# EAGLE design HeadNode V2 (EAGLE 6.4)

## Sheet 1 of 5: Power
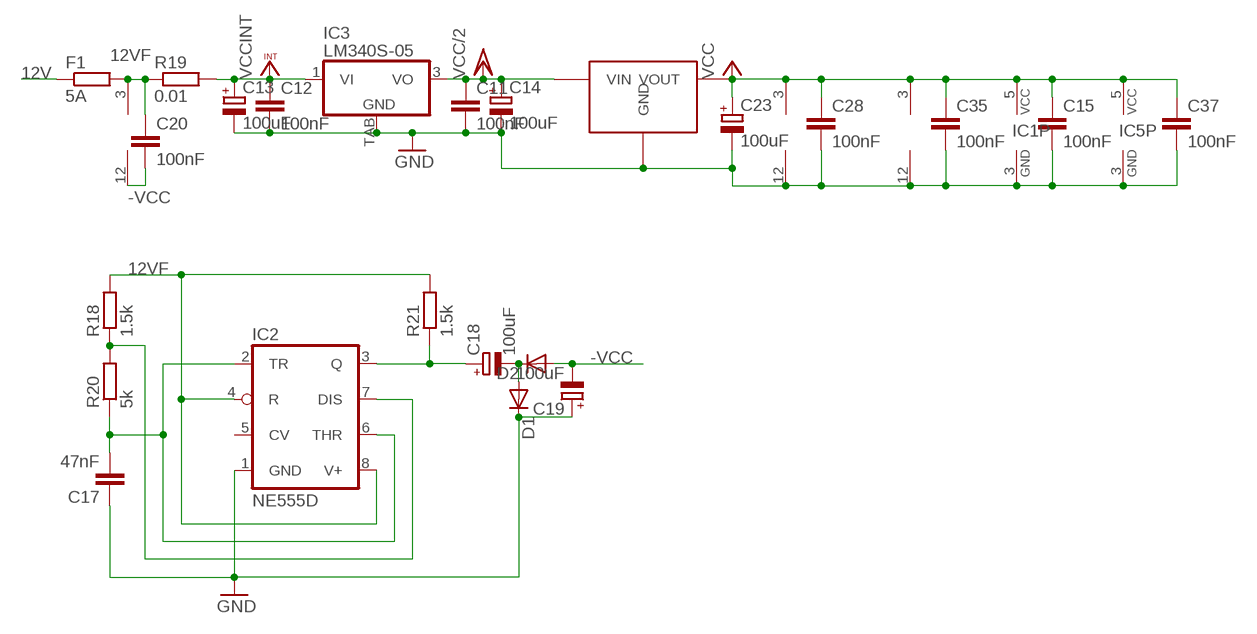
[diagram p0: schematic, sheet 1]

### Parts
C11  100nF  C-EUC0805  [C0805]
C12  100nF  C-EUC0805  [C0805]
C13  100uF  CPOL-EU153CLV-0605  [153CLV-0605]
C14  100uF  CPOL-EU153CLV-0605  [153CLV-0605]
C15  100nF  C-EUC0805  [C0805]
C17  47nF  C-EUC0805  [C0805]
C18  100uF  CPOL-EUD  [PANASONIC_D]
C19  100uF  CPOL-EUD  [PANASONIC_D]
C20  100nF  C-EUC0805  [C0805]
C23  100uF  CPOL-EU153CLV-0605  [153CLV-0605]
C28  100nF  C-EUC0805  [C0805]
C35  100nF  C-EUC0805  [C0805]
C37  100nF  C-EUC0805  [C0805]
D1  DIODE-DO214AA  [DO214AA]
D2  DIODE-DO214AA  [DO214AA]
F1  5A  R-EU_R1206  [R1206]
IC1  74AHCT1G14DBV  [SOT23-5]
IC2  NE555D  [SO08]
IC3  LM340S-05  [TO263-3]
IC4  LM339D  [SO14]
IC5  74AHCT1G14DBV  [SOT23-5]
IC6  LM339D  [SO14]
IC7  LM339D  [SO14]
R18  1.5k  R-EU_R0805  [R0805]
R19  0.01  R-EU_R4527  [R4527]
R20  5k  R-EU_R0805  [R0805]
R21  1.5k  R-EU_R0805  [R0805]
U$5  TS2940  [TO-252]

### Nets
12V: F1.1 ; also sheet 4
12VF: C20.1 F1.2 IC2.4(R) IC2.8(V+) IC4.3(P:V+) R18.2 R19.1 R21.2 ; also sheet 3
-VCC: C19.- C20.2 D2.A IC4.12(P:GND)
GND: C11.2 C12.2 C13.- C14.- C15.2 C17.1 C19.+ C23.- C28.2 C35.2 C37.2 D1.C IC1.3(GND) IC2.1(GND) IC3.TAB(GND) IC5.3(GND) IC6.12(P:GND) IC7.12(P:GND) U$5.GND ; also sheet 2,3,4,5
N$8: C18.+ IC2.3(Q) R21.1
N$10: C18.- D1.A D2.C
N$12: IC2.7(DIS) R18.1 R20.2
N$13: C17.2 IC2.2(TR) IC2.6(THR) R20.1
VCC: C15.1 C23.+ C28.1 C35.1 C37.1 IC1.5(VCC) IC5.5(VCC) IC6.3(P:V+) IC7.3(P:V+) U$5.VOUT ; also sheet 2,3,4,5
VCC/2: C11.1 C14.+ IC3.3(VO) U$5.VIN ; also sheet 4,5
VCCINT: C12.1 C13.+ IC3.1(VI) R19.2 ; also sheet 3
Unconnected: IC2.5(CV)

## Sheet 2 of 5: Logic level
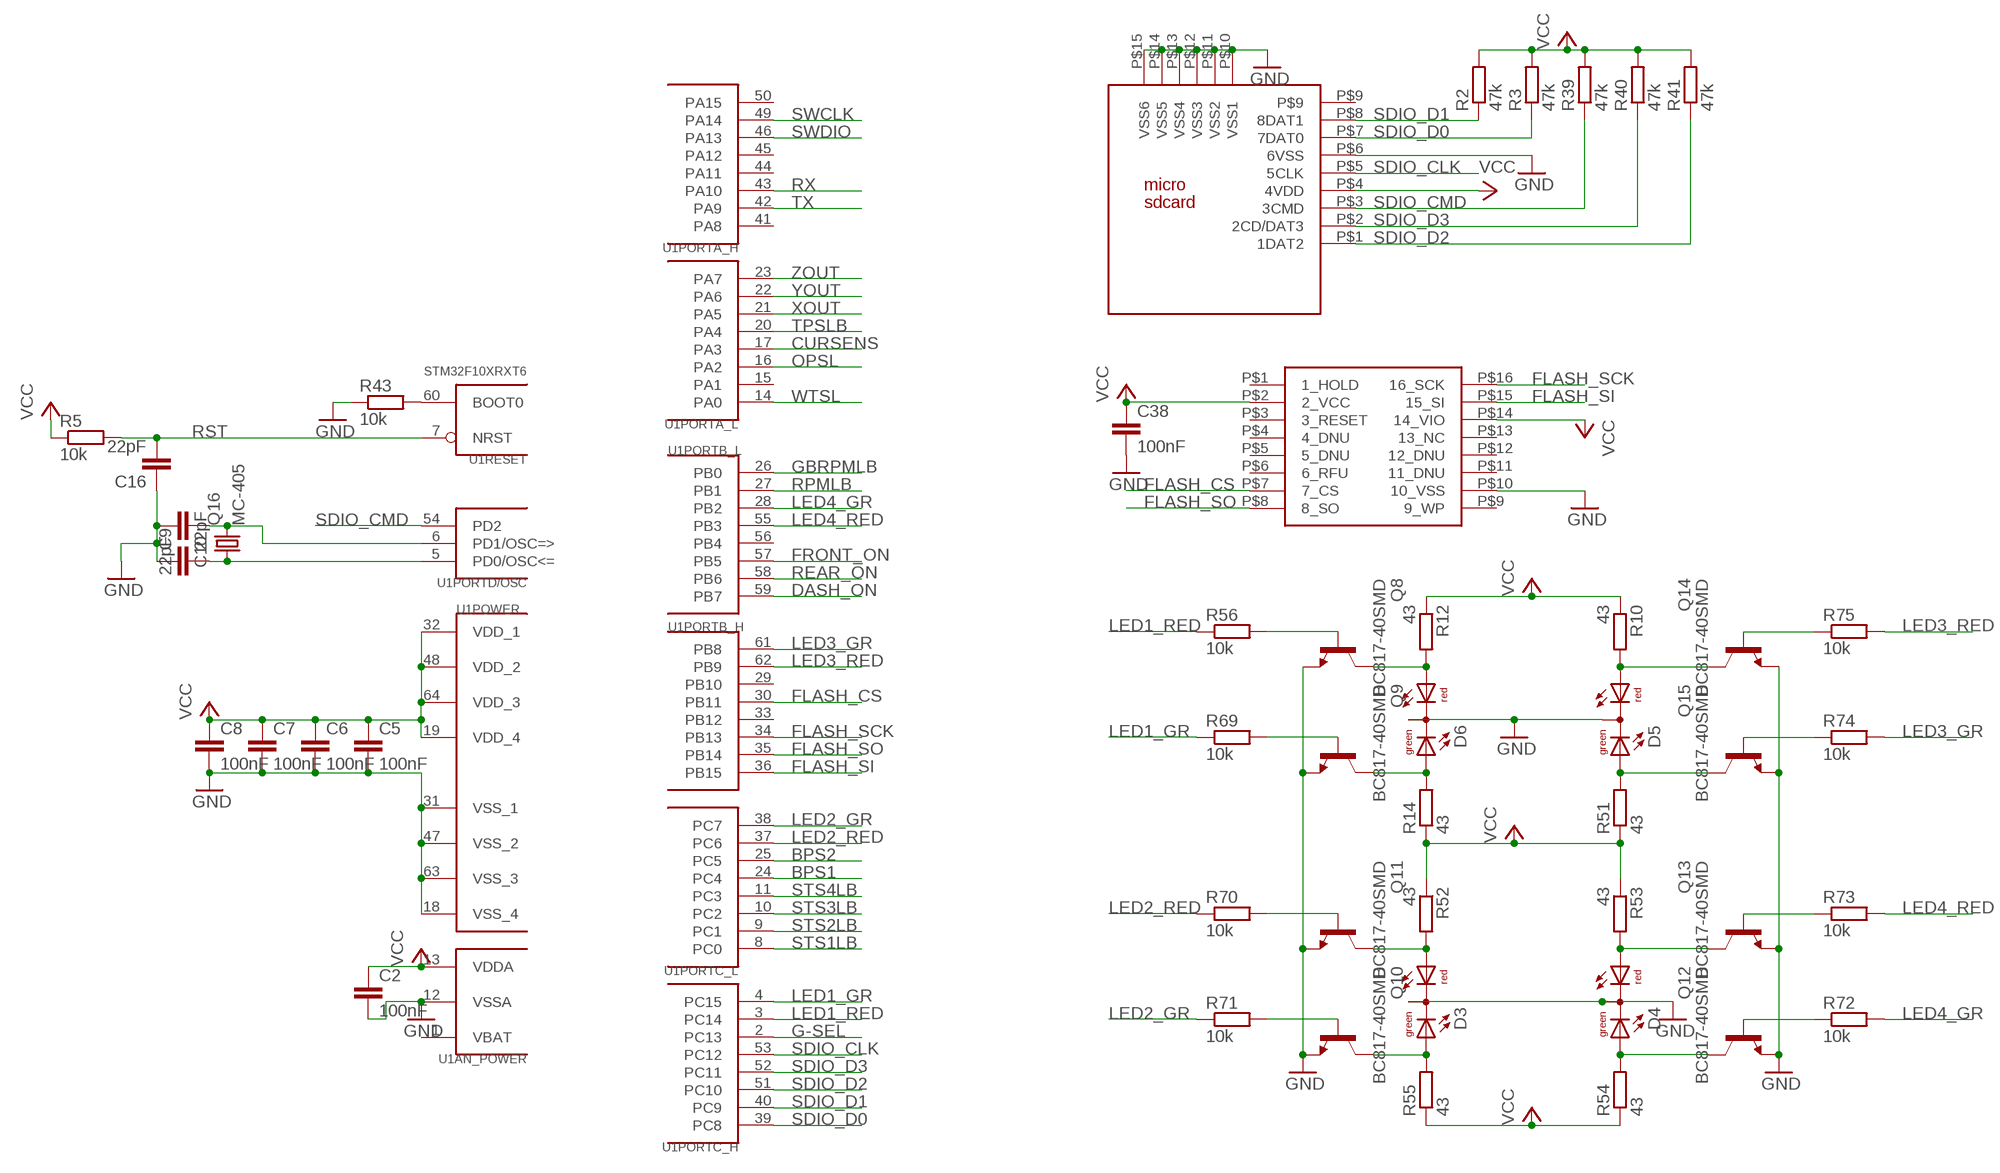
[diagram p1: schematic, sheet 2]

### Parts
C2  100nF  C-EUC0805  [C0805]
C5  100nF  C-EUC0805  [C0805]
C6  100nF  C-EUC0805  [C0805]
C7  100nF  C-EUC0805  [C0805]
C8  100nF  C-EUC0805  [C0805]
C9  22pF  C-EUC0805  [C0805]
C10  22pF  C-EUC0805  [C0805]
C16  22pF  C-EUC0805  [C0805]
C38  100nF  C-EUC0805  [C0805]
D3  DUOLED5MM  [DUOLED5MM]
D4  DUOLED5MM  [DUOLED5MM]
D5  DUOLED5MM  [DUOLED5MM]
D6  DUOLED5MM  [DUOLED5MM]
Q8  BC817-40SMD  [SOT23-BEC]
Q9  BC817-40SMD  [SOT23-BEC]
Q10  BC817-40SMD  [SOT23-BEC]
Q11  BC817-40SMD  [SOT23-BEC]
Q12  BC817-40SMD  [SOT23-BEC]
Q13  BC817-40SMD  [SOT23-BEC]
Q14  BC817-40SMD  [SOT23-BEC]
Q15  BC817-40SMD  [SOT23-BEC]
Q16  MC-405  [MC-405]
R2  47k  R-EU_R0805  [R0805]
R3  47k  R-EU_R0805  [R0805]
R5  10k  R-EU_M0805  [M0805]
R10  43  R-EU_R0805  [R0805]
R12  43  R-EU_R0805  [R0805]
R14  43  R-EU_R0805  [R0805]
R39  47k  R-EU_R0805  [R0805]
R40  47k  R-EU_R0805  [R0805]
R41  47k  R-EU_R0805  [R0805]
R43  10k  R-EU_M0805  [M0805]
R51  43  R-EU_R0805  [R0805]
R52  43  R-EU_R0805  [R0805]
R53  43  R-EU_R0805  [R0805]
R54  43  R-EU_R0805  [R0805]
R55  43  R-EU_R0805  [R0805]
R56  10k  R-EU_R0805  [R0805]
R69  10k  R-EU_R0805  [R0805]
R70  10k  R-EU_R0805  [R0805]
R71  10k  R-EU_R0805  [R0805]
R72  10k  R-EU_R0805  [R0805]
R73  10k  R-EU_R0805  [R0805]
R74  10k  R-EU_R0805  [R0805]
R75  10k  R-EU_R0805  [R0805]
U1  STM32F10XRXT6  [TQFP64]
U$2  MICRO  [MICRO]
U$7  S25FL512SAGMFIG11  [16SOIC]

### Nets
BPS1: U1.24(PORTC_L:PC4) ; also sheet 4
BPS2: U1.25(PORTC_L:PC5) ; also sheet 4
CURSENS: U1.17(PORTA_L:PA3) ; also sheet 3
DASH_ON: U1.59(PORTB_L:PB7) ; also sheet 4
FLASH_CS: U1.30(PORTB_H:PB11) U$7.P$7(7_CS)
FLASH_SCK: U1.34(PORTB_H:PB13) U$7.P$16(16_SCK)
FLASH_SI: U1.36(PORTB_H:PB15) U$7.P$15(15_SI)
FLASH_SO: U1.35(PORTB_H:PB14) U$7.P$8(8_SO)
FRONT_ON: U1.57(PORTB_L:PB5) ; also sheet 4
G-SEL: U1.2(PORTC_H:PC13) ; also sheet 3
GBRPMLB: U1.26(PORTB_L:PB0) ; also sheet 3
GND: C2.2 C5.2 C6.2 C7.2 C8.2 C9.1 C10.2 C16.1 C38.2 D3.K(C) D4.K(C) D5.K(C) D6.K(C) Q8.E Q9.E Q10.E Q11.E Q12.E Q13.E Q14.E Q15.E R43.1 U1.12(AN_POWER:VSSA) U1.18(POWER:VSS_4) U1.31(POWER:VSS_1) U1.47(POWER:VSS_2) U1.63(POWER:VSS_3) U$2.P$6(6VSS) U$2.P$10(VSS1) U$2.P$11(VSS2) U$2.P$12(VSS3) U$2.P$13(VSS4) U$2.P$14(VSS5) U$2.P$15(VSS6) U$7.P$10(10_VSS) ; also sheet 1,3,4,5
LED1_GR: R69.1 U1.4(PORTC_H:PC15)
LED1_RED: R56.1 U1.3(PORTC_H:PC14)
LED2_GR: R71.1 U1.38(PORTC_L:PC7)
LED2_RED: R70.1 U1.37(PORTC_L:PC6)
LED3_GR: R74.2 U1.61(PORTB_H:PB8)
LED3_RED: R75.2 U1.62(PORTB_H:PB9)
LED4_GR: R72.2 U1.28(PORTB_L:PB2)
LED4_RED: R73.2 U1.55(PORTB_L:PB3)
N$2: R43.2 U1.60(RESET:BOOT0)
N$4: C9.2 Q16.1 U1.5(PORTD/OSC:PD0/OSC<=)
N$5: C10.1 Q16.2 U1.6(PORTD/OSC:PD1/OSC=>)
N$6: D5.AR Q14.C R10.2
N$9: D6.AR Q8.C R12.2
N$33: D6.AG Q9.C R14.2
N$50: D5.AG Q15.C R51.2
N$51: D3.AR Q11.C R52.2
N$52: D4.AR Q13.C R53.2
N$53: D4.AG Q12.C R54.2
N$54: D3.AG Q10.C R55.2
N$57: Q8.B R56.2
N$58: Q9.B R69.2
N$59: Q11.B R70.2
N$60: Q10.B R71.2
N$61: Q12.B R72.1
N$62: Q13.B R73.1
N$63: Q15.B R74.1
N$64: Q14.B R75.1
OPSL: U1.16(PORTA_L:PA2) ; also sheet 3
REAR_ON: U1.58(PORTB_L:PB6) ; also sheet 4
RPMLB: U1.27(PORTB_L:PB1) ; also sheet 3
RST: C16.2 R5.2 U1.7(RESET:NRST) ; also sheet 4
RX: U1.43(PORTA_H:PA10) ; also sheet 5
SDIO_CLK: U1.53(PORTC_H:PC12) U$2.P$5(5CLK)
SDIO_CMD: R39.1 U1.54(PORTD/OSC:PD2) U$2.P$3(3CMD)
SDIO_D0: R3.1 U1.39(PORTC_H:PC8) U$2.P$7(7DAT0)
SDIO_D1: R2.1 U1.40(PORTC_H:PC9) U$2.P$8(8DAT1)
SDIO_D2: R41.1 U1.51(PORTC_H:PC10) U$2.P$1(1DAT2)
SDIO_D3: R40.1 U1.52(PORTC_H:PC11) U$2.P$2(2CD/DAT3)
STS1LB: U1.8(PORTC_L:PC0) ; also sheet 3
STS2LB: U1.9(PORTC_L:PC1) ; also sheet 3
STS3LB: U1.10(PORTC_L:PC2) ; also sheet 3
STS4LB: U1.11(PORTC_L:PC3) ; also sheet 3
SWCLK: U1.49(PORTA_H:PA14) ; also sheet 4
SWDIO: U1.46(PORTA_H:PA13) ; also sheet 4
TPSLB: U1.20(PORTA_L:PA4) ; also sheet 3
TX: U1.42(PORTA_H:PA9) ; also sheet 5
VCC: C2.1 C5.1 C6.1 C7.1 C8.1 C38.1 R2.2 R3.2 R5.1 R10.1 R12.1 R14.1 R39.2 R40.2 R41.2 R51.1 R52.1 R53.1 R54.1 R55.1 U1.13(AN_POWER:VDDA) U1.19(POWER:VDD_4) U1.32(POWER:VDD_1) U1.48(POWER:VDD_2) U1.64(POWER:VDD_3) U$2.P$4(4VDD) U$7.P$2(2_VCC) U$7.P$14(14_VIO) ; also sheet 1,3,4,5
WTSL: U1.14(PORTA_L:PA0) ; also sheet 3
XOUT: U1.21(PORTA_L:PA5) ; also sheet 3
YOUT: U1.22(PORTA_L:PA6) ; also sheet 3
ZOUT: U1.23(PORTA_L:PA7) ; also sheet 3
Unconnected: U1.15(PORTA_L:PA1) U1.29(PORTB_H:PB10) U1.33(PORTB_H:PB12) U1.41(PORTA_H:PA8) U1.44(PORTA_H:PA11) U1.45(PORTA_H:PA12) U1.50(PORTA_H:PA15) U1.56(PORTB_L:PB4) U$2.P$9 U$7.P$1(1_HOLD) U$7.P$3(3_RESET) U$7.P$4(4_DNU) U$7.P$5(5_DNU) U$7.P$6(6_RFU) U$7.P$9(9_WP) U$7.P$11(11_DNU) U$7.P$12(12_DNU) U$7.P$13(13_NC)

## Sheet 3 of 5: Analog
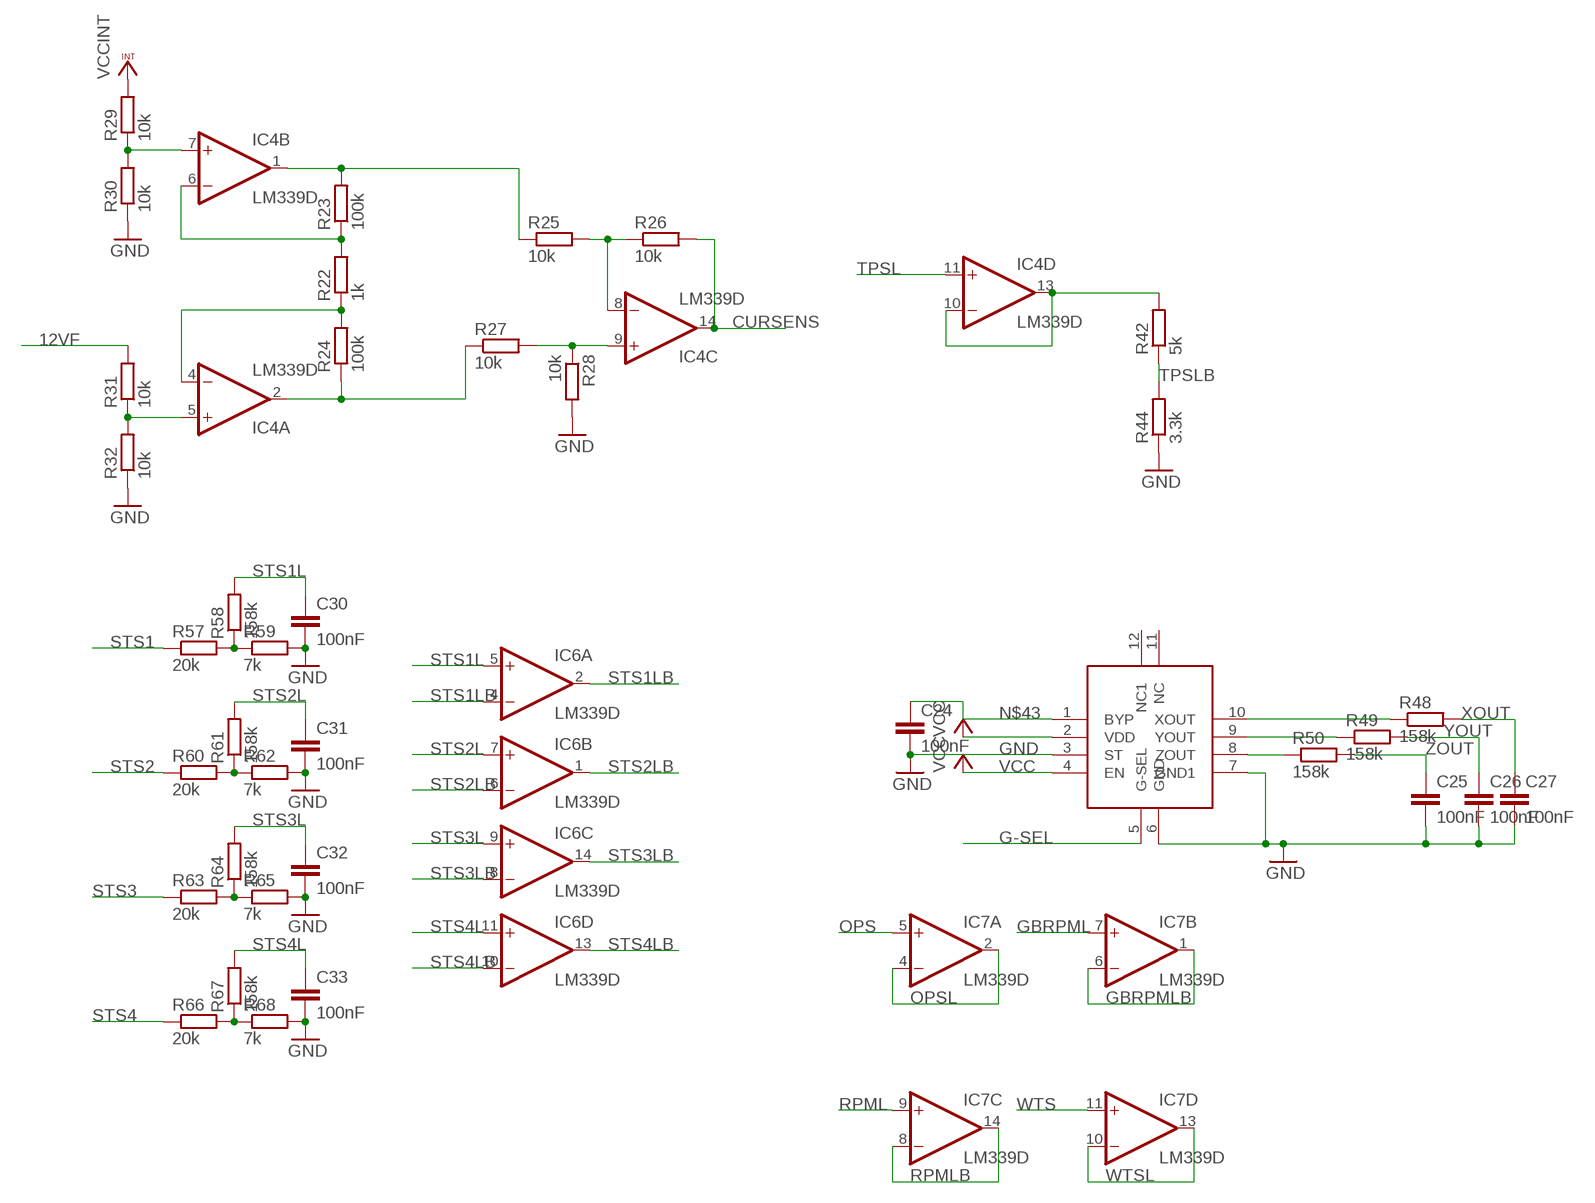
[diagram p2: schematic, sheet 3]

### Parts
C24  100nF  C-EUC0805  [C0805]
C25  100nF  C-EUC0805  [C0805]
C26  100nF  C-EUC0805  [C0805]
C27  100nF  C-EUC0805  [C0805]
C30  100nF  C-EUC0805  [C0805]
C31  100nF  C-EUC0805  [C0805]
C32  100nF  C-EUC0805  [C0805]
C33  100nF  C-EUC0805  [C0805]
R22  1k  R-EU_M0805  [M0805]
R23  100k  R-EU_M0805  [M0805]
R24  100k  R-EU_M0805  [M0805]
R25  10k  R-EU_M0805  [M0805]
R26  10k  R-EU_M0805  [M0805]
R27  10k  R-EU_M0805  [M0805]
R28  10k  R-EU_M0805  [M0805]
R29  10k  R-EU_M0805  [M0805]
R30  10k  R-EU_M0805  [M0805]
R31  10k  R-EU_M0805  [M0805]
R32  10k  R-EU_M0805  [M0805]
R42  5k  R-EU_R0805  [R0805]
R44  3.3k  R-EU_R0805  [R0805]
R48  158k  R-EU_R0805  [R0805]
R49  158k  R-EU_R0805  [R0805]
R50  158k  R-EU_R0805  [R0805]
R57  20k  R-EU_R0805  [R0805]
R58  158k  R-EU_R0805  [R0805]
R59  7k  R-EU_R0805  [R0805]
R60  20k  R-EU_R0805  [R0805]
R61  158k  R-EU_R0805  [R0805]
R62  7k  R-EU_R0805  [R0805]
R63  20k  R-EU_R0805  [R0805]
R64  158k  R-EU_R0805  [R0805]
R65  7k  R-EU_R0805  [R0805]
R66  20k  R-EU_R0805  [R0805]
R67  158k  R-EU_R0805  [R0805]
R68  7k  R-EU_R0805  [R0805]
U$6  FXLN8371QR1  [QFN]

### Nets
12VF: R31.2 ; also sheet 1
CURSENS: IC4.14(C:OUT) R26.2 ; also sheet 2
G-SEL: U$6.5(G-SEL) ; also sheet 2
GBRPML: IC7.7(B:+IN) ; also sheet 4
GBRPMLB: IC7.1(B:OUT) IC7.6(B:-IN) ; also sheet 2
GND: C24.2 C25.2 C26.2 C27.2 C30.2 C31.2 C32.2 C33.2 R28.2 R30.1 R32.1 R44.1 R59.2 R62.2 R65.2 R68.2 U$6.3(ST) U$6.6(GND) U$6.7(GND1) ; also sheet 1,2,4,5
N$7: IC4.6(B:-IN) R22.2 R23.1
N$11: IC4.4(A:-IN) R22.1 R24.2
N$14: IC4.9(C:+IN) R27.2 R28.1
N$16: IC4.1(B:OUT) R23.2 R25.1
N$17: IC4.8(C:-IN) R25.2 R26.1
N$18: IC4.7(B:+IN) R29.1 R30.2
N$19: IC4.5(A:+IN) R31.1 R32.2
N$29: R57.2 R58.1 R59.1
N$36: IC4.10(D:-IN) IC4.13(D:OUT) R42.2
N$37: IC4.2(A:OUT) R24.1 R27.1
N$39: R48.1 U$6.10(XOUT)
N$40: R49.1 U$6.9(YOUT)
N$41: R50.1 U$6.8(ZOUT)
N$43: C24.1 U$6.1(BYP)
N$44: R60.2 R61.1 R62.1
N$46: R63.2 R64.1 R65.1
N$48: R66.2 R67.1 R68.1
OPS: IC7.5(A:+IN) ; also sheet 4
OPSL: IC7.2(A:OUT) IC7.4(A:-IN) ; also sheet 2
RPML: IC7.9(C:+IN) ; also sheet 4
RPMLB: IC7.8(C:-IN) IC7.14(C:OUT) ; also sheet 2
STS1: R57.1 ; also sheet 4
STS1L: C30.1 IC6.5(A:+IN) R58.2
STS1LB: IC6.2(A:OUT) IC6.4(A:-IN) ; also sheet 2
STS2: R60.1 ; also sheet 4
STS2L: C31.1 IC6.7(B:+IN) R61.2
STS2LB: IC6.1(B:OUT) IC6.6(B:-IN) ; also sheet 2
STS3: R63.1 ; also sheet 4
STS3L: C32.1 IC6.9(C:+IN) R64.2
STS3LB: IC6.8(C:-IN) IC6.14(C:OUT) ; also sheet 2
STS4: R66.1 ; also sheet 4
STS4L: C33.1 IC6.11(D:+IN) R67.2
STS4LB: IC6.10(D:-IN) IC6.13(D:OUT) ; also sheet 2
TPSL: IC4.11(D:+IN) ; also sheet 4
TPSLB: R42.1 R44.2 ; also sheet 2
VCC: U$6.2(VDD) U$6.4(EN) ; also sheet 1,2,4,5
VCCINT: R29.2 ; also sheet 1
WTS: IC7.11(D:+IN) ; also sheet 4
WTSL: IC7.10(D:-IN) IC7.13(D:OUT) ; also sheet 2
XOUT: C27.1 R48.2 ; also sheet 2
YOUT: C26.1 R49.2 ; also sheet 2
ZOUT: C25.1 R50.2 ; also sheet 2
Unconnected: U$6.11(NC) U$6.12(NC1)

## Sheet 4 of 5: Connection
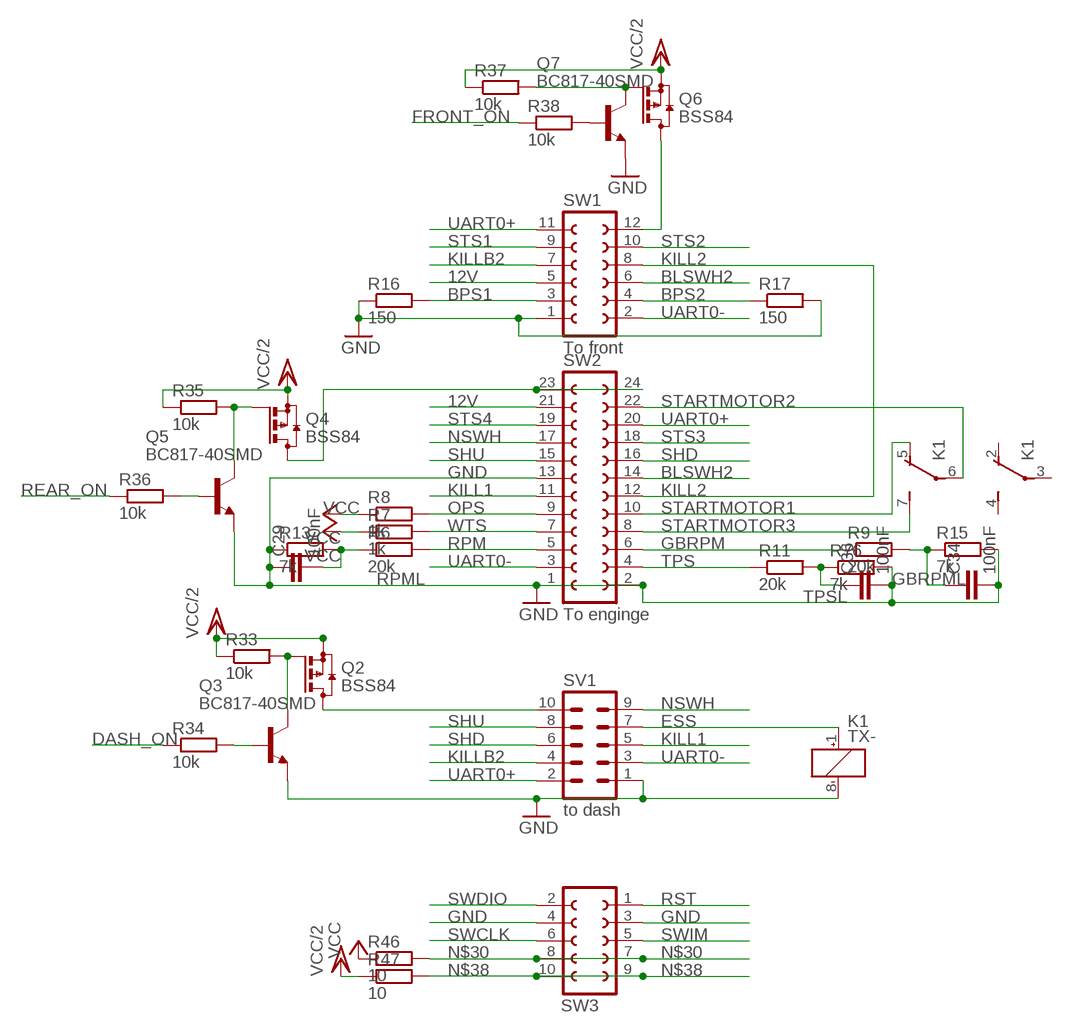
[diagram p3: schematic, sheet 4]

### Parts
C29  100nF  C-EUC0805  [C0805]
C34  100nF  C-EUC0805  [C0805]
C36  100nF  C-EUC0805  [C0805]
K1  TX-  [AGQ]
Q2  BSS84  [SOT23]
Q3  BC817-40SMD  [SOT23-BEC]
Q4  BSS84  [SOT23]
Q5  BC817-40SMD  [SOT23-BEC]
Q6  BSS84  [SOT23]
Q7  BC817-40SMD  [SOT23-BEC]
R6  20k  R-EU_R0805  [R0805]
R7  1k  R-EU_R0805  [R0805]
R8  1k  R-EU_R0805  [R0805]
R9  20k  R-EU_R0805  [R0805]
R11  20k  R-EU_R0805  [R0805]
R13  7k  R-EU_R0805  [R0805]
R15  7k  R-EU_R0805  [R0805]
R16  150  R-EU_R0805  [R0805]
R17  150  R-EU_R0805  [R0805]
R33  10k  R-EU_R0805  [R0805]
R34  10k  R-EU_R0805  [R0805]
R35  10k  R-EU_R0805  [R0805]
R36  10k  R-EU_R0805  [R0805]
R37  10k  R-EU_R0805  [R0805]
R38  10k  R-EU_R0805  [R0805]
R46  10  R-EU_R0805  [R0805]
R47  10  R-EU_R0805  [R0805]
R76  7k  R-EU_R0805  [R0805]
SV1  to dash  MA05-2  [MA05-2]
SW1  To front  FE06-2  [FE06-2]
SW2  To enginge  FE12-2  [FE12-2]
SW3  To front  FE05-2W  [FE05-2W]

### Nets
12V: SW1.5 SW2.21 ; also sheet 1
BLSWH2: SW1.6 SW2.14
BPS1: R16.2 SW1.3 ; also sheet 2
BPS2: R17.1 SW1.4 ; also sheet 2
DASH_ON: R34.1 ; also sheet 2
ESS: K1.1(_:+) SV1.7
FRONT_ON: R38.1 ; also sheet 2
GBRPM: R9.1 SW2.6
GBRPML: C34.1 R9.2 R15.1 ; also sheet 3
GND: C29.1 C34.2 C36.2 K1.8(_:-) Q3.E Q5.E Q7.E R13.1 R15.2 R16.1 R17.2 R76.2 SV1.1 SW1.1 SW2.1 SW2.2 SW2.13 SW3.3 SW3.4 ; also sheet 1,2,3,5
KILL1: SV1.5 SW2.11
KILL2: SW1.8 SW2.12
KILLB2: SV1.4 SW1.7
N$20: Q2.3(D) SV1.10
N$21: Q3.B R34.2
N$22: Q2.1(G) Q3.C R33.2
N$23: Q4.3(D) SW2.23 SW2.24
N$24: Q4.1(G) Q5.C R35.2
N$25: Q5.B R36.2
N$26: Q6.3(D) SW1.12
N$27: Q6.1(G) Q7.C R37.2
N$28: Q7.B R38.2
N$30: R46.2 SW3.7 SW3.8
N$38: R47.2 SW3.9 SW3.10
NSWH: SV1.9 SW2.17
OPS: R8.2 SW2.9 ; also sheet 3
REAR_ON: R36.1 ; also sheet 2
RPM: R6.2 SW2.5
RPML: C29.2 R6.1 R13.2 ; also sheet 3
RST: SW3.1 ; also sheet 2
SHD: SV1.6 SW2.16
SHU: SV1.8 SW2.15
STARTMOTOR1: K1.5(O) SW2.10
STARTMOTOR2: K1.6(P) SW2.22
STARTMOTOR3: K1.7(S) SW2.8
STS1: SW1.9 ; also sheet 3
STS2: SW1.10 ; also sheet 3
STS3: SW2.18 ; also sheet 3
STS4: SW2.19 ; also sheet 3
SWCLK: SW3.6 ; also sheet 2
SWDIO: SW3.2 ; also sheet 2
SWIM: SW3.5
TPS: R11.1 SW2.4
TPSL: C36.1 R11.2 R76.1 ; also sheet 3
UART0+: SV1.2 SW1.11 SW2.20 ; also sheet 5
UART0-: SV1.3 SW1.2 SW2.3 ; also sheet 5
VCC: R7.1 R8.1 R46.1 ; also sheet 1,2,3,5
VCC/2: Q2.2(S) Q4.2(S) Q6.2(S) R33.1 R35.1 R37.1 R47.1 ; also sheet 1,5
WTS: R7.2 SW2.7 ; also sheet 3
Unconnected: K1.2(O) K1.3(P) K1.4(S)

## Sheet 5 of 5: Communication
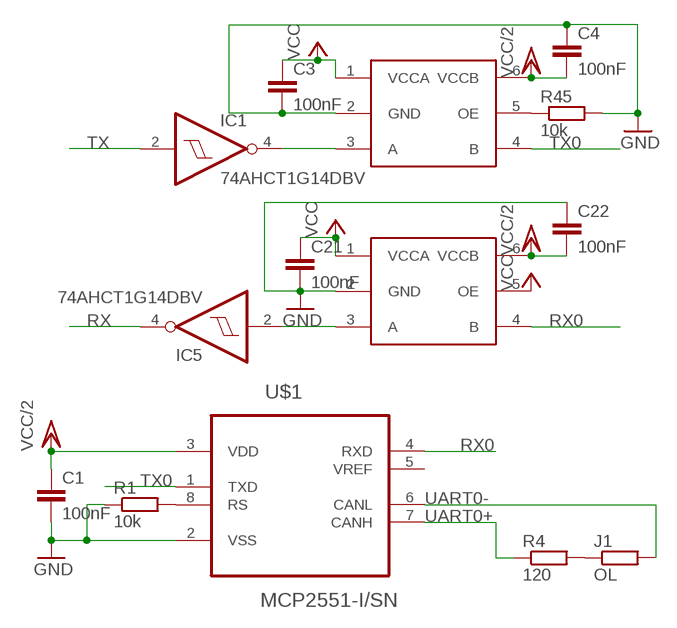
[diagram p4: schematic, sheet 5]

### Parts
C1  100nF  C-EUC0805  [C0805]
C3  100nF  C-EUC0805  [C0805]
C4  100nF  C-EUC0805  [C0805]
C21  100nF  C-EUC0805  [C0805]
C22  100nF  C-EUC0805  [C0805]
J1  OL  R-EU_R0805  [R0805]
R1  10k  R-EU_M0805  [M0805]
R4  120  R-EU_R0805  [R0805]
R45  10k  R-EU_R0805  [R0805]
U$1  MCP2551-I/SN  [SOIC127P600X175-8N]
U$3  TXB0101  [TSOT23-6_DDC]
U$4  TXB0101  [TSOT23-6_DDC]

### Nets
GND: C1.2 C3.2 C4.1 C21.2 C22.1 R1.1 R45.2 U$1.2(VSS) U$3.2(GND) U$4.2(GND) ; also sheet 1,2,3,4
N$1: R1.2 U$1.8(RS)
N$3: R45.1 U$3.5(OE)
N$31: IC1.4(O) U$3.3(A)
N$34: IC5.2(I) U$4.3(A)
N$35: J1.1 R4.2
RX: IC5.4(O) ; also sheet 2
RX0: U$1.4(RXD) U$4.4(B)
TX: IC1.2(I) ; also sheet 2
TX0: U$1.1(TXD) U$3.4(B)
UART0+: R4.1 U$1.7(CANH) ; also sheet 4
UART0-: J1.2 U$1.6(CANL) ; also sheet 4
VCC: C3.1 C21.1 U$3.1(VCCA) U$4.1(VCCA) U$4.5(OE) ; also sheet 1,2,3,4
VCC/2: C1.1 C4.2 C22.2 U$1.3(VDD) U$3.6(VCCB) U$4.6(VCCB) ; also sheet 1,4
Unconnected: U$1.5(VREF)

## Power pins joined to a net without a drawn wire
VBAT: U1.1(AN_POWER:VBAT)

## Library data of the parts
C1-C12 C15 C16 C20-C22 C24-C38 = rcl:C-EU: CAPACITOR, European symbol
C13 C14 C18 C19 C23 = rcl:CPOL-EU: POLARIZED CAPACITOR, European symbol; FARNELL: 1244406RL
C17 = rcl:C-EU: CAPACITOR, European symbol; FARNELL: MCSH31B473K160CT
D1 D2 = diode:DIODE-: DIODE; FARNELL: SS13B
D3-D6 = led:DUOLED5MM: DUO LED 2 colors, 5 mm, round; FARNELL: 8007627
F1 = resistor:R-EU_: RESISTOR, European symbol; FARNELL: MC12CF 005
IC1 IC5 = 74xx-little-us:74*1G14: Single Schmitt-Trigger Inverter Gate
IC2 = linear:*555: TIMER
IC3 = linear:LM340?-*: Positive VOLTAGE REGULATOR Source: http://cache.national.com/ds/LM/LM340.pdf; FARNELL: LM1084ISX-5.0/NOPB
IC4 IC6 IC7 = linear:LM339: Low Power Low Offset Voltage Quad Comparators with open collector; LM139/LM239/LM339/LM2901/LM3302
J1 R2-R4 R6-R18 R20 R21 R33-R42 R44-R76 = rcl:R-EU_: RESISTOR, European symbol
K1 = relay:TX?-*: TX Relais NAiS TX-D RELAYS HIGH INSULATION Conforming to the supplementary insulation class of EN Standards (EN41003) Source: http://www.mew-europe.com/.. en_ds_61022_0007.pdf TX-S RELAYS SMALL POLARIZED RELAY WITH HIGH SENSITIVITY 50mW Source: http://www.mew-europe.com/.. en_ds_61022_0022.pdf; FARNELL: AGQ210A4HZJ
Q2 Q4 Q6 = transistor-small-signal:BSS84: P-CHANNEL MOS FET; FARNELL: TSM2311CX
Q3 Q5 Q7-Q15 = transistor-npn:BC817*: NPN Transistor
Q16 = crystal:MC-405: kHz RANGE CRYSTAL UNIT SMD Source: MC-306_405_406_E07X.PDF Homepage <http://www.epsontoyocom.co.jp>; OC_FARNELL: unknown; OC_NEWARK: unknown
R1 R5 R22-R32 R43 = resistor:R-EU_: RESISTOR, European symbol
R19 = rcl:R-EU_: RESISTOR, European symbol; FARNELL: OARS1 - R010FI
SV1 = con-lstb:MA05-2: PIN HEADER; OC_FARNELL: unknown; OC_NEWARK: unknown
SW1 = con-lsta:FE06-2: FEMALE HEADER; OC_FARNELL: unknown; OC_NEWARK: unknown
SW2 = con-lsta:FE12-2: FEMALE HEADER; OC_FARNELL: unknown; OC_NEWARK: unknown
SW3 = con-lsta:FE05-2W: FEMALE HEADER; OC_FARNELL: unknown; OC_NEWARK: unknown
U1 = stm32:STM32F10XRXT6: STM32F101/103 64pin LQFP
U$1 = mcp:MCP2551-I/SN: High-Speed CAN Transceiver; MPN: MCP2551-I/SN; OC_FARNELL: 9758569; OC_NEWARK: 69K7604; PACKAGE: SOIC-8; SUPPLIER: Microchip
U$2 = farnell:MICRO; FARNELL: 2134442
U$3 U$4 = texas:TXB0101
U$5 = LDO:TS2940
U$6 = FXLN8371QR1:FXLN8371QR1; FARNELL: 2450801
U$7 = spansion:S25FL512SAGMFIG11; FARNELL: 2340548

## Board
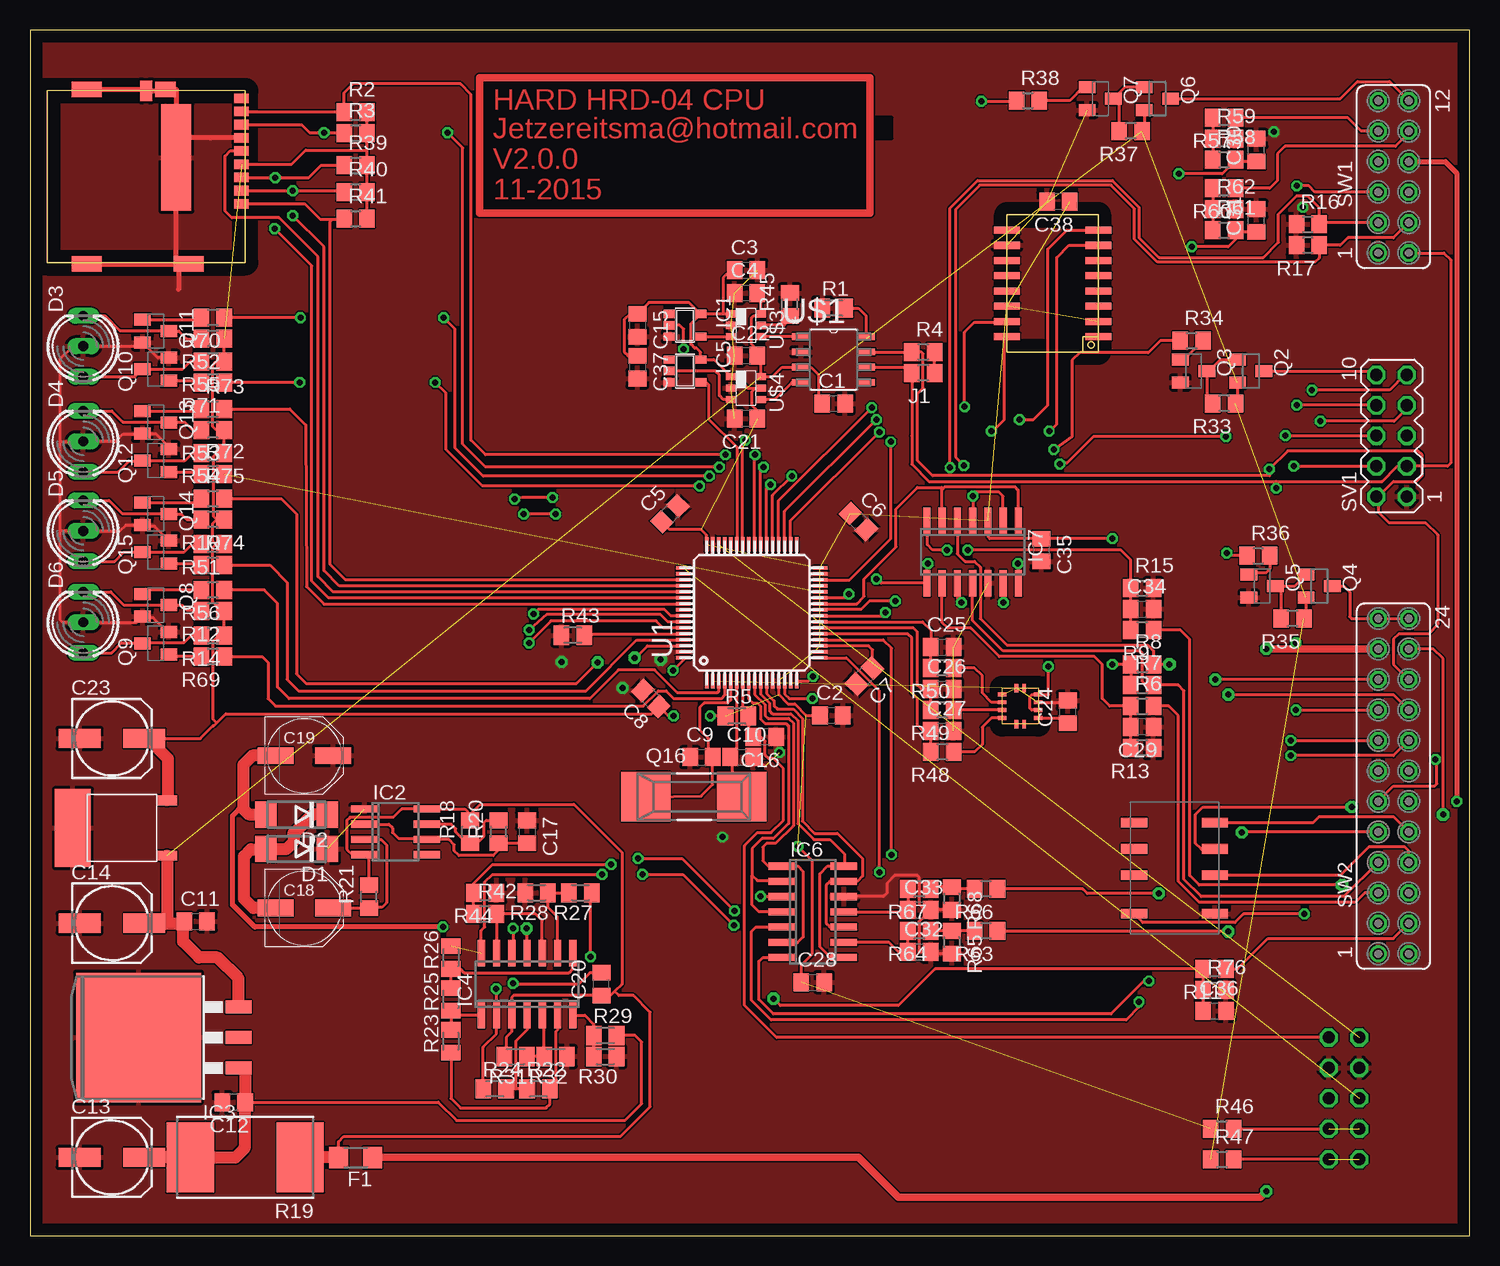
[diagram p5: board, top side]
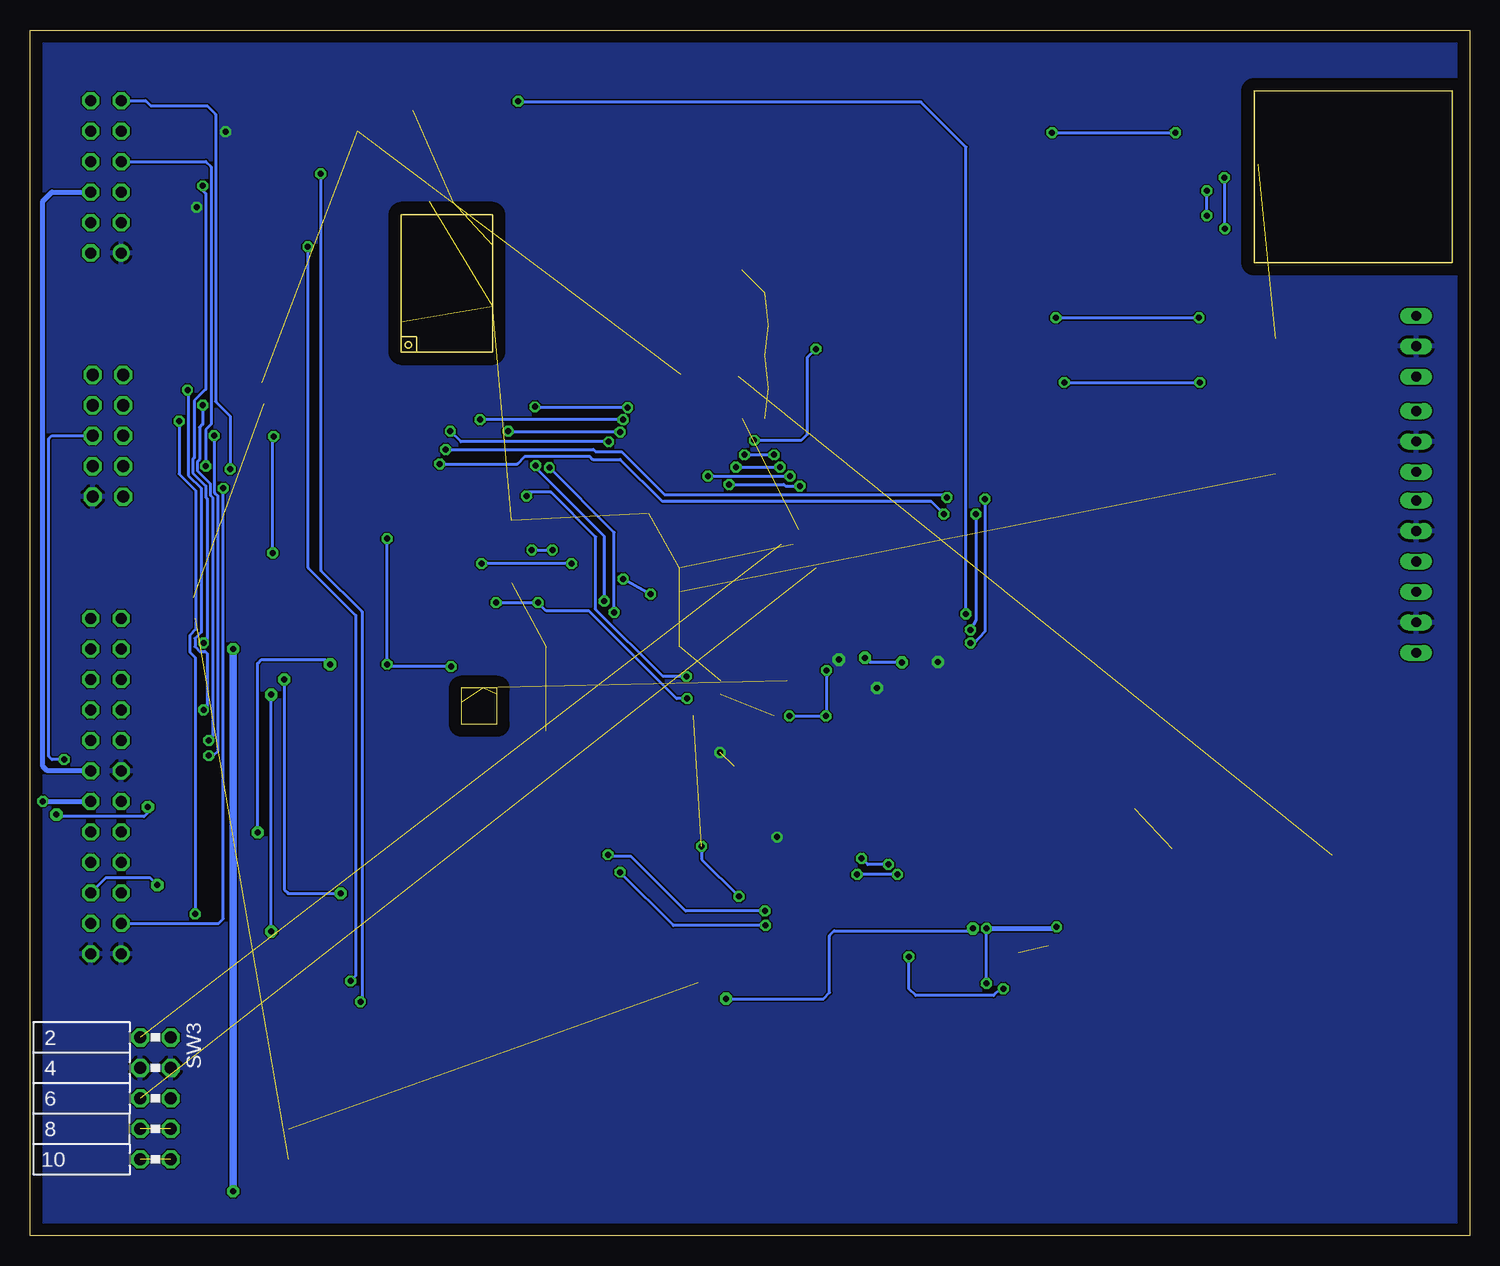
[diagram p6: board, bottom side, seen from below]

Size 120 x 100.5 mm. Coordinates in mm from the lower left corner, seen from the top.
Outline: 0,0 120,0 120,100.5 0,100.5 0,0
Copper layers (1*16): Top 0.035mm / dielectric 1.5mm / Bottom 0.035mm
Design rules "default *": minimum track width 10mil, minimum drill 15mil, track to track 5mil, track to pad 5mil, pad to pad 5mil, via to via 5mil, smd to smd 2mil, copper to edge 40mil, drill to drill 8mil, minimum pad ring 10mil, minimum via ring 8mil, stop-mask expansion 4mil, vias tented up to drill 0mil, thermal gap 10mil

### Footprints (pad centres in the part's own frame; a part is rotated, then mirrored left to right if it is on the bottom)
C0805 = smd 1.3 x 1.5: 1 -0.95,0; 2 0.95,0
153CLV-0605 = smd 3.5 x 1.6: + 2.7,0; - -2.7,0
PANASONIC_D = smd 3 x 1.4: + 2.4,0; - -2.4,0
DO214AA = smd 1.8 x 2.2: A 2.55,0; C -2.55,0
DUOLED5MM = drill 0.813 long: AG -2.54,0; AR 2.54,0; K 0,0
R1206 = smd 1.6 x 1.803: 1 -1.422,0; 2 1.422,0
SOT23-5 = smd 0.69 x 0.99: 1 -0.95,-1.29; 2 0,-1.29; 3 0.95,-1.29; 4 0.95,1.3; 5 -0.95,1.3
SO08 = smd 0.6 x 2.2: 1 -1.905,-2.6; 2 -0.635,-2.6; 3 0.635,-2.6; 4 1.905,-2.6; 5 1.905,2.6; 6 0.635,2.6; 7 -0.635,2.6; 8 -1.905,2.6
TO263-3 = smd 1.067 x 2.159: 1 -2.54,-5.791; 2 0,-5.791; 3 2.54,-5.791 | smd 10.8 x 10.41: TAB 0,2.54
SO14 = smd 0.6 x 2.2: 1 -3.81,-2.6; 2 -2.54,-2.6; 3 -1.27,-2.6; 4 0,-2.6; 5 1.27,-2.6; 6 2.54,-2.6; 7 3.81,-2.6; 8 3.81,2.6; 9 2.54,2.6; 10 1.27,2.6; 11 0,2.6; 12 -1.27,2.6; 13 -2.54,2.6; 14 -3.81,2.6
R0805 = smd 1.3 x 1.5: 1 -0.95,0; 2 0.95,0
AGQ = smd 0.8 x 2.184: 1 -5.4,3.37; 2 -2.2,3.37; 3 0,3.37; 4 2.2,3.37; 5 2.2,-3.37; 6 0,-3.37; 7 -2.2,-3.37; 8 -5.4,-3.37
SOT23 = smd 1 x 1.4: 1 -0.95,-1.1; 2 0.95,-1.1; 3 0,1.1
SOT23-BEC = smd 1 x 1.4: B -0.95,-1.1; C 0,1.1; E 0.95,-1.1
MC-405 = smd 4.1 x 4.1: 1 -4,0; 2 4,0
M0805 = smd 1.3 x 1.6: 1 -0.95,0; 2 0.95,0
R4527 = smd 3.94 x 5.84: 1 -4.575,0; 2 4.575,0
MA05-2 = drill 1.016 octagon: 1 -5.08,-1.27; 2 -5.08,1.27; 3 -2.54,-1.27; 4 -2.54,1.27; 5 0,-1.27; 6 0,1.27; 7 2.54,-1.27; 8 2.54,1.27; 9 5.08,-1.27; 10 5.08,1.27
FE06-2 = drill 0.914: 1 -6.35,1.27 | drill 0.914 octagon: 2 -6.35,-1.27; 3 -3.81,1.27; 4 -3.81,-1.27; 5 -1.27,1.27; 6 -1.27,-1.27; 7 1.27,1.27; 8 1.27,-1.27; 9 3.81,1.27; 10 3.81,-1.27; 11 6.35,1.27; 12 6.35,-1.27
FE12-2 = drill 0.914: 1 -13.97,1.27 | drill 0.914 octagon: 2 -13.97,-1.27; 3 -11.43,1.27; 4 -11.43,-1.27; 5 -8.89,1.27; 6 -8.89,-1.27; 7 -6.35,1.27; 8 -6.35,-1.27; 9 -3.81,1.27; 10 -3.81,-1.27; 11 -1.27,1.27; 12 -1.27,-1.27; 13 1.27,1.27; 14 1.27,-1.27; 15 3.81,1.27; 16 3.81,-1.27; 17 6.35,1.27; 18 6.35,-1.27; 19 8.89,1.27; 20 8.89,-1.27; 21 11.43,1.27; 22 11.43,-1.27; 23 13.97,1.27; 24 13.97,-1.27
FE05-2W = drill 1.016 octagon: 1 -5.08,1.27; 2 -5.08,-1.27; 3 -2.54,1.27; 4 -2.54,-1.27; 5 0,1.27; 6 0,-1.27; 7 2.54,1.27; 8 2.54,-1.27; 9 5.08,1.27; 10 5.08,-1.27
TQFP64 = smd 1.2 x 0.3: 1 -5.7,3.75; 2 -5.7,3.25; 3 -5.7,2.75; 4 -5.7,2.25; 5 -5.7,1.75; 6 -5.7,1.25; 7 -5.7,0.75; 8 -5.7,0.25; 9 -5.7,-0.25; 10 -5.7,-0.75; 11 -5.7,-1.25; 12 -5.7,-1.75; 13 -5.7,-2.25; 14 -5.7,-2.75; 15 -5.7,-3.25; 16 -5.7,-3.75; 33 5.7,-3.75; 34 5.7,-3.25; 35 5.7,-2.75; 36 5.7,-2.25; 37 5.7,-1.75; 38 5.7,-1.25; 39 5.7,-0.75; 40 5.7,-0.25; 41 5.7,0.25; 42 5.7,0.75; 43 5.7,1.25; 44 5.7,1.75; 45 5.7,2.25; 46 5.7,2.75; 47 5.7,3.25; 48 5.7,3.75 | smd 0.3 x 1.2: 17 -3.75,-5.7; 18 -3.25,-5.7; 19 -2.75,-5.7; 20 -2.25,-5.7; 21 -1.75,-5.7; 22 -1.25,-5.7; 23 -0.75,-5.7; 24 -0.25,-5.7; 25 0.25,-5.7; 26 0.75,-5.7; 27 1.25,-5.7; 28 1.75,-5.7; 29 2.25,-5.7; 30 2.75,-5.7; 31 3.25,-5.7; 32 3.75,-5.7; 49 3.75,5.7; 50 3.25,5.7; 51 2.75,5.7; 52 2.25,5.7; 53 1.75,5.7; 54 1.25,5.7; 55 0.75,5.7; 56 0.25,5.7; 57 -0.25,5.7; 58 -0.75,5.7; 59 -1.25,5.7; 60 -1.75,5.7; 61 -2.25,5.7; 62 -2.75,5.7; 63 -3.25,5.7; 64 -3.75,5.7
SOIC127P600X175-8N = smd 1.473 x 0.559: 1 -2.718,1.905; 2 -2.718,0.635; 3 -2.718,-0.635; 4 -2.718,-1.905; 5 2.718,-1.905; 6 2.718,-0.635; 7 2.718,0.635; 8 2.718,1.905
MICRO = smd 0.8 x 1.2: P$1 4.88,0.3; P$2 5.98,0.3; P$3 7.08,0.3; P$4 8.18,0.3; P$5 9.28,0.3; P$6 10.38,0.3; P$7 11.48,0.3; P$8 12.58,0.3; P$9 13.68,0.3 | smd 1.3 x 2.5: P$10 -0.13,4.7; P$11 -0.13,13.2; P$12 14.43,13.2 | smd 1.3 x 1.7: P$13 14.43,6.65 | smd 1.7 x 1: P$14 14.3,8.25 | smd 8.9 x 2.5: P$15 8.75,5.75
TSOT23-6_DDC = smd 0.6 x 0.8: 1 -0.95,-1.25; 2 0,-1.25; 3 0.95,-1.25; 4 0.95,1.25; 5 0,1.25; 6 -0.95,1.25
TO-252 = smd 6.5 x 3: GND 0,4.2 | smd 0.813 x 1.676: VIN -2.3,-3.65; VOUT 2.3,-3.65
QFN = smd 0.686 x 0.33: 1 -1.5,0.975; 2 -1.5,0.325; 3 -1.5,-0.325; 4 -1.5,-0.975; 7 1.5,-0.975; 8 1.5,-0.325; 9 1.5,0.325; 10 1.5,0.975 | smd 0.33 x 0.686: 5 -0.325,-1.5; 6 0.325,-1.5; 11 0.325,1.5; 12 -0.325,1.5
16SOIC = smd 0.6 x 2.2: P$1 -3.81,-3.81; P$2 -2.54,-3.81; P$3 -1.27,-3.81; P$4 0,-3.81; P$5 1.27,-3.81; P$6 2.54,-3.81; P$7 3.81,-3.81; P$8 5.08,-3.81; P$9 5.08,3.81; P$10 3.81,3.81; P$11 2.54,3.81; P$12 1.27,3.81; P$13 0,3.81; P$14 -1.27,3.81; P$15 -2.54,3.81; P$16 -3.81,3.81

### Placement (x,y rotation side)
C1  66.99,69.37 0 top
C2  66.8,43.37 0 top
C3  59.69,80.49 0 top
C4  59.69,78.58 0 top
C5  53.34,60.17 45 top
C6  69.06,59.53 315 top
C7  69.56,46.64 225 top
C8  51.75,44.77 135 top
C9  55.98,39.88 0 top
C10  59.34,39.88 0 top
C11  13.81,26.19 0 top
C12  16.99,11.11 180 top
C13  6.83,6.51 0 top
C14  6.83,26.04 0 top
C15  50.64,75.88 270 top
C16  61.25,41.56 180 top
C17  41.43,33.66 270 top
C18  22.86,27.3 0 top
C19  22.86,40.01 0 top
C20  47.62,20.95 90 top
C21  59.69,68.1 180 top
C22  59.69,73.34 0 top
C23  6.83,41.43 0 top
C24  86.52,43.66 90 top
C25  76.04,49.05 0 top
C26  76.04,45.56 0 top
C27  76.04,42.07 0 top
C28  65.25,21.11 0 top
C29  92.71,42.39 180 top
C30  102.23,90.49 90 top
C31  102.23,84.61 90 top
C32  74.14,23.65 0 top
C33  74.14,27.15 0 top
C34  92.71,52.23 0 top
C35  84.3,57.15 270 top
C36  98.74,18.73 0 top
C37  50.64,72.39 270 top
C38  85.72,86.2 180 top
D1  22.23,32.23 180 top
D2  22.23,35.08 180 top
D3  4.45,74.14 90 top
D4  4.45,66.2 90 top
D5  4.45,58.74 90 top
D6  4.45,51.12 90 top
F1  27.15,6.51 180 top
IC1  54.61,75.88 270 top
IC2  30.48,33.66 270 top
IC3  11.59,16.51 90 top
IC4  41.43,20.95 0 top
IC5  54.61,72.07 270 top
IC6  65.25,26.99 270 top
IC7  78.58,56.99 180 top
J1  74.45,71.91 180 top
K1  95.41,32.23 90 top
Q2  101.76,72.07 270 top
Q3  97,72.07 270 top
Q4  107.47,54.13 270 top
Q5  102.71,54.13 270 top
Q6  93.98,94.77 270 top
Q7  89.22,94.77 270 top
Q8  10.48,52.55 270 top
Q9  10.48,49.37 90 top
Q10  10.48,72.23 90 top
Q11  10.48,75.41 270 top
Q12  10.48,64.61 90 top
Q13  10.48,67.79 270 top
Q14  10.48,60.17 270 top
Q15  10.48,56.99 90 top
Q16  55.34,36.58 0 top
R1  66.99,77.31 0 top
R2  27.15,93.66 0 top
R3  27.15,91.92 0 top
R4  74.45,73.66 0 top
R5  58.93,43.31 0 top
R6  92.71,44.13 0 top
R7  92.71,45.88 0 top
R8  92.71,47.62 0 top
R9  92.71,50.48 180 top
R10  15.24,59.69 180 top
R11  98.74,22.23 180 top
R12  15.24,52.07 180 top
R13  92.71,40.64 180 top
R14  15.24,50.01 180 top
R15  92.71,53.98 0 top
R16  106.52,84.3 0 top
R17  106.52,82.55 180 top
R18  36.67,33.66 90 top
R19  17.94,6.51 180 top
R20  39.05,33.66 90 top
R21  28.26,28.26 90 top
R22  42.39,12.22 0 top
R23  35.08,16.19 90 top
R24  38.73,12.22 0 top
R25  35.08,19.68 90 top
R26  35.08,23.18 90 top
R27  45.88,28.57 180 top
R28  42.23,28.57 180 top
R29  47.94,16.67 0 top
R30  47.94,14.92 180 top
R31  40.48,14.92 180 top
R32  43.81,14.92 180 top
R33  99.54,69.37 180 top
R34  96.84,74.61 0 top
R35  105.25,51.44 180 top
R36  102.39,56.67 0 top
R37  91.76,92.08 180 top
R38  83.19,94.61 0 top
R39  27.15,89.22 0 top
R40  27.15,87 0 top
R41  27.15,84.77 0 top
R42  37.94,26.83 0 top
R43  45.24,50.04 0 top
R44  37.94,28.57 180 top
R45  63.34,77.63 90 top
R46  99.38,8.89 0 top
R47  99.38,6.35 0 top
R48  76.04,40.32 180 top
R49  76.04,43.81 180 top
R50  76.04,47.31 180 top
R51  15.24,57.63 180 top
R52  15.24,74.77 180 top
R53  15.24,67.15 180 top
R54  15.24,65.25 180 top
R55  15.24,72.87 180 top
R56  15.24,53.82 180 top
R57  99.54,93.19 180 top
R58  99.54,89.69 0 top
R59  99.54,91.44 0 top
R60  99.54,87.31 180 top
R61  99.54,83.82 0 top
R62  99.54,85.57 0 top
R63  79.69,25.4 180 top
R64  74.14,25.4 180 top
R65  76.83,24.45 270 top
R66  79.69,28.89 180 top
R67  74.14,28.89 180 top
R68  76.83,28.1 270 top
R69  15.24,48.26 180 top
R70  15.24,76.52 180 top
R71  15.24,71.12 180 top
R72  15.24,63.5 0 top
R73  15.24,68.9 0 top
R74  15.24,55.88 0 top
R75  15.24,61.44 0 top
R76  98.74,20.48 0 top
SV1  113.51,66.67 90 top
SW1  113.67,88.27 90 top
SW2  113.67,37.47 90 top
SW3  109.54,11.43 270 bottom
U1  60.17,51.91 90 top
U$1  66.99,73.03 0 top
U$2  17.94,81.12 90 top
U$3  59.69,75.88 270 top
U$4  59.69,70.64 270 top
U$5  7.78,33.97 90 top
U$6  82.55,44.13 180 top
U$7  85.25,78.74 90 top

### Tracks (layer width: path | path; a pad name or v marks a point on that pad's centre or on a via)
12V  (via drill 0.5 pad 0.81, 0.5 pad 1.02)
  Top 0.254: SW1.5 107.12,87 106.62,87.5 v105.6,87.5 | v105.54,49.4 105.41,48.9
  Top 0.61: F1.1 69.06,6.51 72.39,3.17 102.55,3.17 v103.06,3.68 | v103.06,48.9 105.41,48.9 SW2.21
  Bottom 0.254: v105.6,87.5 105.6,87.12 105.35,86.87 105.35,70.55 106.3,69.6 106.3,64.83 106.43,64.71 106.43,63.56 105.35,62.48 105.35,61.53 105.22,61.4 105.22,49.72 v105.54,49.4
  Bottom 0.61: v103.06,3.68 v103.06,48.9
12VF
  Top 0.254: R31.2 39.69,15.08 39.69,16.51 40.16,16.99 IC4.3 40.16,19.84 40.33,20 C20.1 48.39,20 48.74,20.35 | R21.2 28.26,31.37 IC2.4 27.82,31.69 26.92,31.69 26.42,32.19 26.42,34.61 26.67,34.86 30.29,34.86 30.99,35.56 IC2.8 36.26,35.56 36.7,35.12 36.7,34.64 R18.2 36.67,35.08 37.53,35.94 45.34,35.94 49.34,31.94 49.34,20.95 48.74,20.35 | F1.2 25.72,7.82 26.16,8.26 49.21,8.26 51.69,10.73 51.69,18.61 50.29,20 49.09,20 48.74,20.35
  Top 1.016: F1.2 23.3,6.51 23.3,6.54 22.51,6.54 R19.1
-VCC  (via drill 0.5 pad 0.81)
  Top 0.254: C20.2 46.67,21.91 45.72,20.95 40.32,20.95 v40.26,21.02 | v40.26,25.59 40.26,23.65 IC4.12
  Top 0.406: v34.42,25.72 18.73,25.72 16.89,27.56 16.89,34.99 17.78,35.88
  Top 1.016: C19.- 18.54,40.01 17.78,39.24 17.78,35.88 17.78,35.56 18.22,35.12 19.64,35.12 D2.A
  Bottom 0.254: v40.26,21.02 v40.26,25.59
  Bottom 0.406: v40.26,25.59 34.54,25.59 v34.42,25.72
BLSWH2
  Bottom 0.406: SW2.14 118.56,38.73 118.94,39.12 118.94,86.23 118.17,87 SW1.6
BPS1  (via drill 0.5 pad 0.81)
  Top 0.254: SW1.3 107.63,84.45 R16.2 107.44,84.33 107.44,85.72 106.49,86.68 105.6,86.68 104.08,85.15 104.08,82.8 102.81,81.53 94.11,81.53 92.46,83.19 92.46,85.72 90.23,87.95 78.99,87.95 76.71,85.66 v76.71,64.01 | U1.24 71.03,51.66 v71.31,51.94
  Bottom 0.254: v71.31,51.94 71.31,58.61 v76.71,64.01
BPS2  (via drill 0.5 pad 0.81)
  Top 0.254: SW1.4 113.67,83.19 109.86,83.19 109.22,82.55 R17.1 107.47,81.5 107.12,81.15 93.98,81.15 92.08,83.06 92.08,85.6 90.11,87.57 79.18,87.57 77.15,85.53 77.15,64.9 v77.85,64.2 | v72.14,52.9 69.98,52.9 69.28,52.2 65.9,52.2 U1.25
  Bottom 0.254: v77.85,64.2 77.85,64.01 72.14,58.29 v72.14,52.9
CURSENS  (via drill 0.5 pad 0.81)  (1 unrouted)
  Top 0.254: U1.17 68.04,48.16 70.8,45.4 v70.8,30.29 | IC4.14 37.62,25.43 37.91,25.72 37.91,29.46 38.54,30.1 v47.69,30.1 | v51.05,30.1 54.42,30.1 v58.67,25.84
  Bottom 0.254: v47.69,30.1 v51.05,30.1 | v58.67,25.84 66.36,25.84 v70.8,30.29
DASH_ON  (via drill 0.5 pad 0.81)
  Top 0.254: U1.59 52.78,50.66 52.2,51.24 43.43,51.24 v41.59,49.4 | R34.1 94.23,74.61 93.22,73.6 87.5,73.6 86.87,72.96 86.87,66.61 v85.34,65.53 | v43.56,61.53 41.02,61.53 v40.39,61.4
  Bottom 0.254: v85.34,65.53 73.03,65.53 72.83,65.34 70.67,65.34 67.12,61.78 43.81,61.78 v43.56,61.53 | v40.39,61.4 40.39,50.35 41.27,49.4 v41.59,49.4
ESS  (via drill 0.5 pad 0.81)
  Top 0.254: SV1.7 114.78,68.93 113.73,67.88 v107.57,67.88 | v106.24,26.8 101.16,26.8 100.46,26.1 92.77,26.1 K1.1
  Bottom 0.254: v107.57,67.88 107.57,63.5 106.17,62.1 106.17,50.55 106.68,50.04 106.68,48.64 106.24,48.2 v106.24,26.8
FLASH_CS  (via drill 0.5 pad 0.81)
  Top 0.254: U1.30 68.31,54.66 71.75,58.1 v71.75,66.17 | v84.96,67.06 85.6,67.63 85.6,81.53 86.61,82.55 U$7.P$7
  Bottom 0.254: v71.75,66.17 84.07,66.17 v84.96,67.06
FLASH_SCK  (via drill 0.5 pad 0.81)
  Top 0.254: U1.34 63.42,59.61 v70.8,66.99 | v80.14,67.06 80.58,67.37 81.22,68.01 81.22,74.71 U$7.P$16
  Bottom 0.254: v70.8,66.99 79.95,66.99 v80.14,67.06
FLASH_SI  (via drill 0.5 pad 0.81)
  Top 0.254: U1.36 62.42,61.27 v70.17,69.03 | v77.92,69.09 77.92,75.31 78.74,76.14 81.38,76.14 U$7.P$15
  Bottom 0.254: v70.17,69.03 77.53,69.03 v77.92,69.09
FLASH_SO  (via drill 0.5 pad 0.81)
  Top 0.254: U1.35 62.92,60.38 v70.55,68.01 | v82.49,68.01 83.63,68.01 84.84,69.22 84.84,82.23 86.42,83.82 U$7.P$8
  Bottom 0.254: v70.55,68.01 v82.49,68.01
FRONT_ON  (via drill 0.5 pad 0.81)
  Top 0.254: U1.57 53.43,51.66 52.9,52.2 42.35,52.2 v41.97,51.82 | v79.31,94.55 82.17,94.55 R38.1
  Bottom 0.254: v41.97,51.82 41.97,90.74 45.72,94.49 79.25,94.49 v79.31,94.55
G-SEL  (1 unrouted)
GBRPM  (via drill 0.5 pad 1.02)
  Top 0.254: v109.38,29.21 97.47,29.21 96.68,30 96.68,49.69 95.89,50.48 R9.1
  Bottom 0.254: SW2.6 113.67,29.84 110.01,29.84 v109.38,29.21
GBRPML  (via drill 0.5 pad 0.81)
  Top 0.254: R9.2 C34.1 R15.1 91.76,56.32 90.93,57.15 v78.17,57.15 | v76.45,57.15 75.25,57.15 74.8,57.59 74.8,59.56 IC7.7
  Bottom 0.254: v78.17,57.15 v76.45,57.15
GBRPMLB
  Top 0.254: IC7.6 76.04,62.2 76.11,62.26 | 76.11,62.26 76.26,62.42 82.11,62.42 82.36,62.17 82.36,59.62 IC7.1 | U1.26 68.92,52.66 69.53,53.28 69.53,54.74 72.2,57.4 72.2,60.58 73.98,62.36 76.01,62.36 76.11,62.26
GND  (via drill 0.5 pad 0.81, 0.5 pad 1.02)  (14 unrouted)
  Top 0.254: R65.2 75.24,23.5 C32.2 74.14,23.65 74.14,26.2 C33.2 | R68.2 C33.2 | C33.2 74.61,27.15 74.14,27.62 74.14,29.84 73.98,30 72.07,30 71.44,29.37 71.44,28.57 71.12,28.26 IC6.12 | U$6.3 86.37,44.46 C24.2 | Q10.E 10.65,73.18 Q11.E 9.06,74.14 D3.K 4.41,74.11 3.56,74.11 2.54,73.09 2.54,66.17 | Q12.E 11.58,65.77 10.54,66.8 9.41,66.8 Q13.E 9.34,66.8 7.75,66.8 7.14,66.2 D4.K 2.57,66.2 2.54,66.17 | 2.54,58.74 D5.K 7.49,58.74 8,59.24 9.35,59.24 Q14.E 9.47,59.12 10.41,59.12 11.58,57.95 Q15.E | 2.54,58.74 2.54,66.17 | Q9.E 11.46,50.32 10.29,51.5 9.47,51.5 Q8.E 8.9,51.12 D6.K 2.73,51.12 2.54,51.31 2.54,58.74 | C10.2 60.52,39.88 61.28,39.12
  Top 0.406: U$2.P$12 9.69,95.55 U$2.P$14 11.29,95.42 U$2.P$13 12.19,95.55 U$2.P$15 | U$2.P$6 15.05,91.5 12.19,91.5 U$2.P$15 | 12.38,80.99 12.19,80.99 | 12.19,80.99 U$2.P$15 | U$2.P$10 12.38,80.99 | 12.38,80.99 12.38,78.87 | U$2.P$11 12.19,80.99
  other vias: 52.58,48.01 49.4,45.66 44.32,47.82 103.7,92.01 106.11,85.72 62.48,40.26 57.72,33.21
  pour Bottom: -5.71,107.51 129.29,107.51 129.29,-5.71 -5.71,-5.71
  pour Top: -6.16,108.08 131,108.08 131,-7.05 -6.16,-7.05
KILL1  (via drill 0.5 pad 0.81)
  Top 0.254: SW2.11 113.67,37.47 117.09,37.47 117.28,37.66 117.28,39.56 v117.16,39.69
  Bottom 0.254: v117.16,39.69 118.17,39.69 118.43,39.94 118.43,66.42 118.17,66.67 SV1.5
KILL2  (via drill 0.5 pad 0.81)
  Top 0.406: SW1.8 117.98,89.53 118.94,88.58 v118.94,36.2
  Bottom 0.406: v118.94,36.2 SW2.12
KILLB2  (via drill 0.5)
  Top 0.254: v105.35,64.14 SV1.4
  Bottom 0.254: SW1.7 105.35,89.53 104.9,89.09 104.9,67.63 105.35,67.18 v105.35,64.14
LED1_GR
  Top 0.254: R69.1 19.37,48.26 19.84,47.78 19.84,44.77 20.48,44.13 51.12,44.13 52.39,45.4 53.02,45.4 53.66,44.77 57.63,44.77 57.94,45.09 57.94,46.18 U1.4
LED1_RED
  Top 0.254: U1.3 57.42,45.35 57.31,45.24 53.98,45.24 52.07,47.15 49.05,47.15 46.67,44.77 21.59,44.77 20.64,45.72 20.64,52.7 19.53,53.82 R56.1
LED2_GR  (via drill 0.5 pad 0.81)
  Top 0.254: U1.38 61.42,62.3 v61.72,62.61 | v55.82,62.48 37.72,62.48 34.67,65.53 34.67,70.23 v33.78,71.12 | v22.48,71.12 R71.1
  Bottom 0.254: v61.72,62.61 57.15,62.61 57.02,62.48 v55.82,62.48 | v33.78,71.12 v22.48,71.12
LED2_RED  (via drill 0.5 pad 0.81)
  Top 0.254: U1.37 61.92,61.73 v63.5,63.31 | v56.64,63.31 37.78,63.31 35.43,65.66 35.43,75.56 v34.48,76.52 | v22.54,76.52 R70.1
  Bottom 0.254: v63.5,63.31 v56.64,63.31 | v34.48,76.52 v22.54,76.52
LED3_GR
  Top 0.254: R74.2 20,55.88 21.43,54.45 21.43,46.35 22.38,45.4 46.35,45.4 50.58,49.62 54.38,49.62 U1.61
LED3_RED  (via drill 0.5 pad 1.02)
  Top 0.254: R75.2 20.95,61.44 22.23,60.17 22.23,46.83 23.02,46.04 45.56,46.04 v47.31,47.78 | v50.39,48.16 50.51,48.2 51.47,49.15 54.41,49.16 U1.62
  Bottom 0.254: v47.31,47.78 50.01,47.78 v50.39,48.16
LED4_GR  (1 unrouted)
LED4_RED
  Top 0.254: R73.2 21.65,68.9 22.99,67.56 23.05,54.1 24.51,52.64 54.42,52.64 U1.55
N$1
  Top 0.254: R1.2 69.06,77.31 69.69,76.68 69.69,74.95 U$1.8
N$2
  Top 0.254: R43.2 46.48,50.04 46.61,50.16 U1.60
N$3
  Top 0.254: R45.1 63.34,76.36 62.87,75.88 U$3.5
N$4
  Top 0.254: U1.5 58.42,44.64 58.17,44.39 56.2,44.39 55.82,44.01 55.82,42.16 56.52,41.47 56.52,40.54 C9.2 56.9,39.85 56.9,37.59 55.94,36.64 Q16.1
N$5
  Top 0.254: U1.6 58.92,39.9 C10.1 58.55,39.78 58.55,38.29 59.66,37.18 Q16.2
N$6
  Top 0.254: D5.AR 6.6,61.28 7.68,60.2 11.55,60.2 Q14.C 12.61,60.17 13.08,59.69 R10.2
N$7
  Top 0.254: IC4.6 43.97,17.14 43.81,16.99 43.81,12.7 R22.2 43.34,10.95 43.02,10.64 35.88,10.64 35.08,11.43 R23.1
N$8
  Top 0.254: IC2.3 29.27,33.02 29.72,32.58 29.72,27.75 29.34,27.37 28.32,27.37 R21.1 C18.+
N$9
  Top 0.254: D6.AR 6.73,53.66 7.81,52.58 11.55,52.58 Q8.C 12.67,52.55 13.08,52.13 14.23,52.13 R12.2
N$10
  Top 1.016: D2.C 23.53,35.08 21.97,33.53 21.97,32.83 21.34,32.19 19.71,32.19 D1.A 19.64,32.19 18.41,32.19 17.84,31.62 17.84,28.07 18.61,27.3 C18.-
N$11
  Top 0.254: R22.1 40.48,12.22 | 40.48,12.22 R24.2 | IC4.4 41.43,17.14 40.48,16.19 40.48,12.22
N$12
  Top 0.254: IC2.7 35.12,34.29 35.5,33.91 35.5,33.66 36.45,32.7 R18.1 37.28,32.7 37.85,33.27 37.85,34.42 38.04,34.61 R20.2
N$13
  Top 0.254: C17.2 R20.1 39.05,32.13 38.61,31.69 35.75,31.69 35.37,32.07 35.37,32.58 34.92,33.02 IC2.6 33.02,33.08 30.73,33.08 30.23,33.59 30.23,33.97 29.91,34.29 IC2.2
N$14
  Top 0.254: IC4.9 43.97,26.57 43.18,27.37 R28.1 R27.2
N$16
  Top 0.254: IC4.1 35.46,18.36 R25.1 R23.2
N$17
  Top 0.254: R25.2 R26.1 35.88,22.23 36.2,21.91 44.93,21.91 45.24,22.23 IC4.8
N$18
  Top 0.254: IC4.7 46.26,18.36 46.99,17.62 R29.1 R30.2
N$19
  Top 0.254: IC4.5 42.87,18.19 R32.2 R31.1
N$20
  Top 0.254: Q2.3 111.92,72.07 SV1.10
N$21
  Top 0.254: Q3.B 96.2,73.02 R34.2
N$22
  Top 0.254: R33.2 98.1,69.86 Q3.C 98.27,72.07 99.22,73.03 Q2.1
N$23
  Top 0.254: Q4.3 109.54,54.13 110.01,53.66 110.01,51.59 110.17,51.44 SW2.23 SW2.24
N$24
  Top 0.254: R35.2 104.3,53.64 Q5.C 105.42,54.13 Q4.1
N$25
  Top 0.254: R36.2 103.34,55.56 103.03,55.24 101.77,55.24 Q5.B
N$26
  Top 0.254: Q6.3 109.22,94.77 110.65,96.2 113.35,96.2 SW1.12
N$27
  Top 0.254: Q6.1 91.27,95.72 Q7.C 90.81,94.28 R37.2
N$28
  Top 0.254: Q7.B 87.79,95.72 86.68,94.61 R38.2
N$29
  Top 0.254: R57.2 R59.1 R58.1
N$30  (1 unrouted)
  Top 0.254: R46.2 SW3.7
N$31
  Top 0.254: IC1.4 U$3.3
N$32
  Top 0.61: 37.47,96.52 70.01,96.52 70.01,85.25 37.47,85.25 37.47,96.52
N$33
  Top 0.254: R14.2 13.43,50.01 12.83,49.4 9.41,49.4 Q9.C 9.35,49.4 7.62,49.4 6.79,48.58 D6.AG
N$34
  Top 0.254: U$4.3 57.78,69.69 57.47,70.01 57.47,71.75 57.15,72.07 IC5.2
N$35
  Top 0.254: J1.1 R4.2
N$36
  Top 0.254: IC4.13 R42.2 38.92,26.8 42.16,26.8 42.7,26.26 IC4.10
N$37  (via drill 0.5 pad 0.81)
  Top 0.254: R24.1 37.78,15.72 38.89,16.83 IC4.2 38.89,20.54 v38.86,20.57 | v46.74,23.24 46.74,28.48 R27.1
  Bottom 0.254: v38.86,20.57 39.12,20.57 39.69,20 46.16,20 46.74,20.57 v46.74,23.24
N$38  (1 unrouted)
  Top 0.254: SW3.9 R47.2
N$39
  Top 0.254: U$6.10 80.15,43.16 79.38,42.39 79.38,40.96 78.74,40.32 R48.1
N$40
  Top 0.254: U$6.9 R49.1
N$41
  Top 0.254: U$6.8 80.16,44.46 79.38,45.24 79.38,46.67 78.74,47.31 R50.1
N$43
  Top 0.254: U$6.1 86.07,43.16 C24.1
N$44
  Top 0.254: R60.2 R62.1 R61.1
N$46
  Top 0.254: R63.2 R65.1 R64.1
N$48
  Top 0.254: R66.2 76.99,28.89 R68.1 75.24,29.05 R67.1
N$50
  Top 0.254: D5.AG 7.05,56.2 7.81,56.96 9.35,56.96 Q15.C 12.86,56.99 13.4,57.53 14.2,57.53 R51.2
N$51
  Top 0.254: D3.AR 6.25,76.68 7.49,75.44 11.55,75.44 Q11.C 12.41,75.41 13.08,74.74 14.26,74.74 R52.2
N$52
  Top 0.254: D4.AR 6.83,68.74 7.75,67.82 11.55,67.82 Q13.C 11.61,67.75 12.95,67.75 13.56,67.15 R53.2
N$53
  Top 0.254: R54.2 13.56,65.25 12.89,64.58 9.41,64.58 Q12.C 9.35,64.58 8.26,64.58 7.33,63.66 D4.AG
N$54
  Top 0.254: D3.AG 8.74,71.6 Q10.C 12.73,72.23 13.4,72.9 14.26,72.9 R55.2
N$57
  Top 0.254: R56.2 9.7,53.82 Q8.B
N$58
  Top 0.254: R69.2 11.74,48.26 Q9.B
N$59
  Top 0.254: Q11.B 14.13,76.36 R70.2
N$60
  Top 0.254: Q10.B 14.13,71.28 R71.2
N$61
  Top 0.254: Q12.B 14.13,63.66 R72.1
N$62
  Top 0.254: Q13.B 14.13,68.74 R73.1
N$63
  Top 0.254: Q15.B 14.13,56.04 R74.1
N$64
  Top 0.254: Q14.B 13.97,61.12 R75.1
NSWH  (via drill 0.5 pad 0.81)
  Top 0.254: SV1.9 114.62,71.75 113.35,70.48 v106.87,70.48 | v105.54,43.81 SW2.17
  Bottom 0.254: v106.87,70.48 106.81,70.36 106.81,63.37 105.73,62.29 105.73,50.29 106.24,49.78 106.24,49.09 105.86,48.7 105.41,48.7 105.22,48.51 105.22,44.13 v105.54,43.81
OPS  (via drill 0.5 pad 1.02)
  Top 0.254: IC7.5 77.31,56.83 77.95,56.2 78.74,56.2 79.22,55.72 79.22,51.44 81.44,49.21 93.19,49.21 93.66,48.74 R8.2 v95,47.62 | SW2.9 101.09,33.66 v101.03,33.59
  Bottom 0.254: v101.03,33.59 101.03,47.69 100.71,48.01 95.38,48.01 v95,47.62
OPSL  (via drill 0.5 pad 0.81)
  Top 0.254: IC7.2 81.12,61.63 80.77,61.98 78.8,61.98 v78.61,61.66 78.61,59.62 IC7.4 | U1.16 64.88,46.21 v65.28,46.61
  Bottom 0.254: v65.28,46.61 67.25,46.61 72.83,52.2 72.83,58.23 76.58,61.98 78.42,61.98 v78.61,61.66
REAR_ON  (via drill 0.5 pad 0.81)
  Top 0.254: U1.58 53.17,51.16 52.58,51.75 43.05,51.75 v41.59,50.48 | R36.1 99.98,56.67 v99.76,56.9 | v99.69,66.61 88.65,66.61 86.42,64.39 85.92,64.39 v85.85,64.33 | v43.81,60.13 v41.15,60.13
  Bottom 0.254: v99.76,56.9 99.76,66.55 v99.69,66.61 | v85.85,64.33 79.38,64.33 78.74,64.96 73.34,64.96 73.09,64.71 70.8,64.71 67.31,61.21 44.9,61.21 v43.81,60.13 | v41.15,60.13 41.15,51.31 41.34,50.93 v41.59,50.48
RPM
  Top 0.254: SW2.5 111.28,28.57 110.49,27.78 97.47,27.78 95.73,29.53 95.73,43.34 94.93,44.13 R6.2
RPML
  Top 0.254: R13.2 C29.2 R6.1 90.01,44.13 89.38,44.77 89.38,47.62 88.74,48.26 80.8,48.26 78.42,50.64 76.52,50.64 76.04,51.12 IC7.9
RPMLB  (via drill 0.5 pad 0.81)
  Top 0.254: v74.87,56.01 74.77,55.91 IC7.8 70.96,54.39 v70.55,54.74 | v82.36,56.01 82.36,54.42 IC7.14 | v68.26,53.47 67.94,53.15 U1.27
  Bottom 0.254: v74.87,56.01 v82.36,56.01 | v70.55,54.74 70.17,54.55 v68.26,53.47
RST
  Top 0.254: U1.7 59.42,43.77 R5.2 59.88,41.6 C16.2 60.33,41.59 60.9,41.59 61.28,41.21 61.28,40.07 61.59,39.75 61.98,39.75 62.8,38.92 62.8,34.61 61.78,33.59 60.64,33.59 59.56,32.51 59.56,19.18 62.23,16.51 SW3.1
RX
  Top 0.254: IC5.4 56.39,71.12 56.58,70.93 56.58,68.07 58.93,65.72 58.93,57.62 U1.43
RX0
  Top 0.254: U$1.4 63.5,71.12 62.07,69.69 U$4.4
SDIO_CLK
  Top 0.254: U1.53 25.27,53.66 24,54.93 24,81.6 20.77,84.84 16.83,84.84 16.26,85.41 16.26,89.98 16.7,90.42 17.62,90.42 U$2.P$5
SDIO_CMD  (via drill 0.5 pad 0.81)
  Top 0.254: U$2.P$3 v20.45,88.2 20.95,88.2 23.24,88.2 24.26,89.22 R39.1 | U1.54 24.88,53.16 23.5,54.55 23.5,80.83 v20.38,83.95
  Bottom 0.254: v20.38,83.95 20.38,88.14 v20.45,88.2
SDIO_D0  (via drill 0.5 pad 0.81)
  Top 0.254: U$2.P$7 22.65,92.6 23.3,91.95 24,91.95 v24.51,91.95 26.16,91.95 R3.1 | U1.39 60.92,63.84 v61.15,64.07 | v57.47,64.07 37.97,64.07 36.07,65.98 36.07,90.68 v34.8,91.95
  Bottom 0.254: v61.15,64.07 v57.47,64.07 | v34.8,91.95 v24.51,91.95
SDIO_D1  (via drill 0.5 pad 0.81)
  Top 0.254: U$2.P$8 26.16,93.7 R2.1 26.16,93.7 26.16,95.25 26.92,96.01 35.88,96.01 36.77,95.12 36.77,66.29 37.97,65.09 v57.98,65.09 | U1.40 60.42,65.05 v60.45,65.09
  Bottom 0.254: v60.45,65.09 v57.98,65.09
SDIO_D2
  Top 0.254: U$2.P$1 22.9,86 24.19,84.71 25.21,84.71 | 25.21,84.71 26.13,84.71 R41.1 | U1.51 26.3,54.66 25.02,55.94 25.02,84.52 25.21,84.71
SDIO_D3  (via drill 0.5 pad 0.81)
  Top 0.254: U$2.P$2 v21.91,87.1 22.42,87.1 26.09,87.1 R40.1 | U1.52 25.79,54.16 24.51,55.44 24.51,82.42 v21.91,85.03
  Bottom 0.254: v21.91,85.03 v21.91,87.1
SHD  (via drill 0.5 pad 0.81)
  Top 0.254: v104.65,66.67 SV1.6 | SW2.16 113.67,40.01 v105.09,40.01
  Bottom 0.254: v104.65,66.67 104.58,66.61 104.58,61.91 104.33,61.66 104.33,40.39 104.71,40.01 v105.09,40.01
SHU  (via drill 0.5 pad 0.81)
  Top 0.254: SV1.8 v105.6,69.22 | v105.09,41.27 SW2.15
  Bottom 0.254: v105.6,69.22 105.6,67.63 105.86,67.37 105.86,64.71 106.05,64.52 106.05,63.75 104.97,62.67 104.97,61.72 104.78,61.53 104.78,41.59 v105.09,41.27
STARTMOTOR1
  Top 0.254: K1.5 106.97,34.43 107.47,34.92 113.67,34.92 SW2.10
STARTMOTOR2  (via drill 0.5 pad 1.02)
  Top 0.254: K1.6 97.63,32.23 97.16,32.7 97.16,35.08 97.79,35.72 v110.17,35.72 | v117.79,35.08 117.79,48.1 117,48.9 SW2.22
  Bottom 0.254: v110.17,35.72 110.17,35.24 110.49,34.92 117.63,34.92 v117.79,35.08
STARTMOTOR3
  Top 0.254: SW2.8 114.94,32.07 114.62,32.38 111.6,32.38 109.22,30 98.8,30 K1.7
STS1
  Top 0.254: R57.1 109.86,93.19 110.97,92.08 SW1.9
STS1L  (via drill 0.5 pad 0.81)
  Top 0.254: C30.1 100.64,89.54 | 100.64,89.54 R58.2 | 100.64,89.54 100.4,89.54 99.38,88.52 v95.76,88.52 | v92.46,19.49 92.46,19.05 91.38,17.97 61.78,17.97 60.13,19.62 60.13,25.34 60.52,25.72 IC6.5
  Bottom 0.254: v95.76,88.52 95.76,55.44 92.33,52.01 92.33,19.62 v92.46,19.49
STS1LB
  Top 0.254: U1.8 59.92,44.73 60.26,44.39 60.64,44.39 60.9,44.13 60.9,43.05 61.28,42.67 63.06,42.67 63.25,42.48 63.25,34.35 61.98,33.08 61.02,33.08 60.2,32.26 60.2,30.04 | 60.2,30.04 60.64,29.59 62.58,29.59 IC6.2 | IC6.4 60.77,26.99 60.2,27.56 60.2,30.04
STS2
  Top 0.254: SW1.10 114.94,91.92 113.82,90.81 104.62,90.81 103.98,90.17 103.98,87.95 103.35,87.31 R60.1
STS2L  (via drill 0.5 pad 0.81)
  Top 0.254: C31.1 100.64,83.66 | 100.64,83.66 R61.2 | 100.64,83.66 100.64,83.18 99.89,82.42 v96.84,82.42 | v93.28,21.21 92.84,21.21 90.11,18.48 61.98,18.48 60.77,19.68 60.77,22.86 61.09,23.18 IC6.7
  Bottom 0.254: v96.84,82.42 96.84,55.69 92.84,51.69 92.84,21.65 v93.28,21.21
STS2LB
  Top 0.254: U1.9 60.42,45.12 61.28,44.26 61.28,43.37 61.53,43.12 63.25,43.12 63.63,42.74 63.63,34.16 62.17,32.7 61.4,32.7 61.09,32.38 61.09,31.24 61.53,30.8 IC6.1 64.01,30.8 64.45,30.35 64.45,24.89 63.94,24.38 62.71,24.38 IC6.6
STS3  (via drill 0.5 pad 1.02)
  Top 0.254: R63.1 99.82,25.4 v99.89,25.34 | v99.89,45.09 113.67,45.09 SW2.18
  Bottom 0.254: v99.89,25.34 v99.89,45.09
STS3L
  Top 0.254: R64.2 C32.1 72.39,23.65 71.6,24.45 IC6.9
STS3LB
  Top 0.254: U1.10 60.92,45.13 61.66,44.39 61.66,43.75 61.91,43.5 63.44,43.5 64.01,42.93 64.01,34.35 65.34,33.02 66.67,33.02 67.88,31.81 67.88,30.83 IC6.14 66.48,30.8 65.85,30.16 65.85,24.07 66.74,23.18 IC6.8
STS4  (via drill 0.5 pad 1.02)
  Top 0.254: SW2.19 v98.81,46.35 | v94.11,28.51 88.14,28.51 87.76,28.89 R66.1
  Bottom 0.254: v98.81,46.35 98.81,28.83 98.49,28.51 v94.11,28.51
STS4L
  Top 0.254: R67.2 C33.1 73.03,26.99 IC6.11
STS4LB
  Top 0.254: U1.11 61.42,45.2 62.04,44.58 62.04,44.13 62.29,43.88 63.63,43.88 64.39,43.12 64.39,34.54 65.41,33.53 67.31,33.53 69.41,31.43 69.41,29.97 68.96,29.53 IC6.13 66.67,29.53 66.36,29.21 66.36,26.04 66.67,25.72 IC6.10
SWCLK  (1 unrouted)
SWDIO  (1 unrouted)
TPS
  Top 0.254: R11.1 100.65,22.23 103.19,24.77 113.67,24.77 SW2.4
TPSL  (via drill 0.5 pad 1.02)
  Top 0.254: C36.1 R76.1 R11.2 75.44,22.23 72.39,19.18 62.55,19.18 v61.98,19.75 | v41.4,25.59 41.4,23.59 IC4.11
  Bottom 0.254: v61.98,19.75 53.85,19.75 53.34,20.26 53.34,25.02 52.96,25.4 41.59,25.4 v41.4,25.59
TPSLB  (via drill 0.5 pad 0.81)
  Top 0.254: U1.20 71.12,49.66 71.82,48.96 v71.82,31.75 | R42.1 R44.2 36.99,29.37 38.54,30.92 v48.45,30.92 | v50.67,31.43 54.36,31.43 v58.74,27.05
  Bottom 0.254: v48.45,30.92 50.16,30.92 v50.67,31.43 | v58.74,27.05 65.34,27.05 69.91,31.62 71.69,31.62 v71.82,31.75
TX  (via drill 0.5 pad 0.81)
  Top 0.254: U1.42 59.42,66.08 v59.63,66.29 | v54.48,73.91 54.48,75.56 54.17,75.88 IC1.2
  Bottom 0.254: v59.63,66.29 55.69,66.29 55.18,66.8 55.18,73.22 v54.48,73.91
TX0
  Top 0.254: U$1.1 U$3.4
UART0+  (via drill 0.5 pad 0.81)
  Top 0.254: U$1.7 R4.1 74.3,73.66 74.45,73.5 74.45,70.64 73.98,70.17 73.98,64.61 75.25,63.34 103.31,63.34 v103.31,63.88 104.84,65.41 115.73,65.41 116.05,65.09 116.05,63.34 115.57,62.87 113.67,62.87 112.39,61.59 | SV1.2 112.39,61.59 | 112.39,61.59 112.39,60.33 113.28,59.44 116.33,59.44 117.35,58.42 117.35,50.93 116.59,50.16 114.11,50.16 113.67,49.72 113.67,47.62 SW2.20
  Bottom 0.254: SW1.11 110.36,94.61 109.92,94.17 105.22,94.17 104.52,93.47 104.52,69.53 103.31,68.33 v103.31,63.88
UART0-  (via drill 0.5 pad 0.81)
  Top 0.254: U$1.6 73.03,72.39 J1.2 73.5,66.68 73.5,64.29 74.93,62.87 103.89,62.87 | 103.89,62.87 112.71,62.87 113.98,64.14 SV1.3 118.17,64.14 118.43,64.39 118.43,81.34 117.86,81.92 SW1.2 | v103.89,62.29 103.89,62.87
  Bottom 0.254: SW2.3 104.27,26.04 103.89,26.42 v103.89,62.29
VCC  (via drill 0.5 pad 0.81)  (13 unrouted)
  Top 0.254: C21.1 60.48,68.26 60.48,68.9 60.17,69.22 60.17,70.33 60.48,70.64 U$4.5 59.85,70.64 58.9,71.59 U$4.1 57.01,73.02 IC5.5 55.91,73.63 55.56,73.98 55.4,73.98 55.09,74.3 55.09,76.01 IC1.5 | U$3.1 57.78,76.83 | 57.78,76.83 IC1.5 | IC1.5 55.88,76.83 54.93,77.79 51.6,77.79 C15.1 50,76.83 49.53,76.36 49.53,73.66 49.85,73.34 C37.1 | C3.1 58.42,80.49 57.78,79.85 57.78,76.83 | R7.1 R8.1 v90.23,47.62 | U$6.2 83.51,43.81 83.34,43.97 83.34,44.93 83.5,45.09 84.03,45.09 U$6.4 84.88,45.11 84.9,45.09 v84.9,47.43 | 15.56,59.69 15.24,59.37 15.24,57.91 15.53,57.63 R51.1 16.16,57.59 15.49,57.59 15.24,57.34 15.24,52.83 16,52.07 R12.1 R14.1 16.16,49.97 15.68,49.97 15.24,49.53 15.24,43.05 15.56,42.74 | R10.1 15.56,59.69 | 15.56,59.69 15.3,59.94 15.3,64.96 15.56,65.22 16.16,65.22 R54.1 R53.1 15.53,67.15 15.24,67.44 15.24,72.58 15.49,72.83 16.16,72.83 R55.1 R52.1 | C23.+ 14.19,41.43 15.24,42.48 15.3,42.48 15.56,42.74 | R41.2 R40.2 R39.2 28.1,90.55 | 28.1,90.55 R3.2 R2.2 | U$2.P$4 21.8,89.3 22.99,90.49 28.03,90.49 28.1,90.55 | U1.13 62.42,45.09 63.18,44.32 63.75,44.32 64.71,43.37 C2.1 | C7.1 70.24,48.83 69.91,49.15 U1.19 | C28.1 64.3,22.58 65.22,23.5 65.22,31.24 v64.01,32.45 | v60.9,28.26 IC6.3 | U1.64 54.47,47.99 v53.59,47.12 | v53.66,43.31 53.21,43.31 C8.1 51.83,43.5 16.32,43.5 15.56,42.74 | R5.1 v56.71,43.31 | IC7.3 79.88,59.56 79.88,58.23 80.01,58.1 C35.1 v90.23,58.1 | U1.48 56.42,58.39 55.94,58.86 53.3,58.86 C5.1
  Top 1.016: C23.+ 9.81,41.43 11.49,39.75 11.49,36.34 U$5.VOUT
  Bottom 0.254: v64.01,32.45 64.01,31.37 v60.9,28.26 | v53.59,47.12 53.59,43.37 v53.66,43.31 v56.71,43.31 | v90.23,58.1 v90.23,47.62 90.04,47.43 v84.9,47.43
VCC/2  (5 unrouted)
  Top 0.254: C1.1 65.72,69.69 65.72,71.75 65.09,72.39 U$1.3 62.71,72.39 61.91,71.59 U$4.6 60.94,73.04 C22.2 60.64,73.82 60.17,74.3 60.17,76.52 60.33,76.68 60.78,76.68 U$3.6 60.94,78.28 C4.2 | Q2.2 100.66,69.55 R33.1 | Q4.2 106.37,51.61 R35.1 | Q6.2 92.88,92.25 R37.1
  Top 1.016: IC3.3 17.38,21.42 15.62,23.18 14.1,23.18 12.76,24.51 12.76,26.1 C11.1 12.7,26.04 11.56,26.04 | C14.+ 11.56,26.04 | U$5.VIN 11.43,26.16 11.56,26.04
VCCINT
  Top 0.254: C12.1 34.04,11.11 35.56,9.59 49.59,9.59 50.99,10.99 50.99,16.13 50.42,16.7 48.92,16.7 R29.2
  Top 1.016: IC3.1 17.94,13.97 C12.1 17.94,7.37 17.84,7.24 17.14,6.51 R19.2 C13.+
WTS
  Top 0.254: IC7.11 78.58,51.28 81.12,48.74 92.55,48.74 92.71,48.58 92.71,46.2 93.03,45.88 R7.2 95.73,45.88 96.2,45.4 96.2,29.69 97.63,28.26 109.54,28.26 SW2.7
WTSL  (via drill 0.5 pad 0.81)
  Top 0.254: IC7.13 81.12,53.05 v81.15,52.77 | v77.66,52.77 77.6,52.77 77.34,53.02 77.34,54.36 IC7.10 | U1.14 62.92,45.16 63.31,44.77 v65.22,44.77
  Bottom 0.254: v81.15,52.77 v77.66,52.77 76.96,52.07 73.41,52.07 66.1,44.77 v65.22,44.77
XOUT
  Top 0.254: R48.2 C27.1 74.45,42.07 73.98,42.55 73.98,44.77 73.5,45.24 73.5,49.85 73.18,50.16 U1.21
YOUT
  Top 0.254: R49.2 C26.1 74.3,45.56 73.98,45.88 73.98,50.32 73.66,50.64 65.89,50.64 U1.22
ZOUT
  Top 0.254: R50.2 C25.1 75.09,50.48 74.41,51.16 U1.23

### Text on the board
Top: HARD HRD-04 CPU | Jetzereitsma@hotmail.com | V2.0.0 | 11-2015